# EAGLE schematic 20150312_QSE_TO_FMC_with_DP_R5.3_for_review (EAGLE 7.2.0), part 1 of 2

## Sheet 1 of 3: HS Diff Links
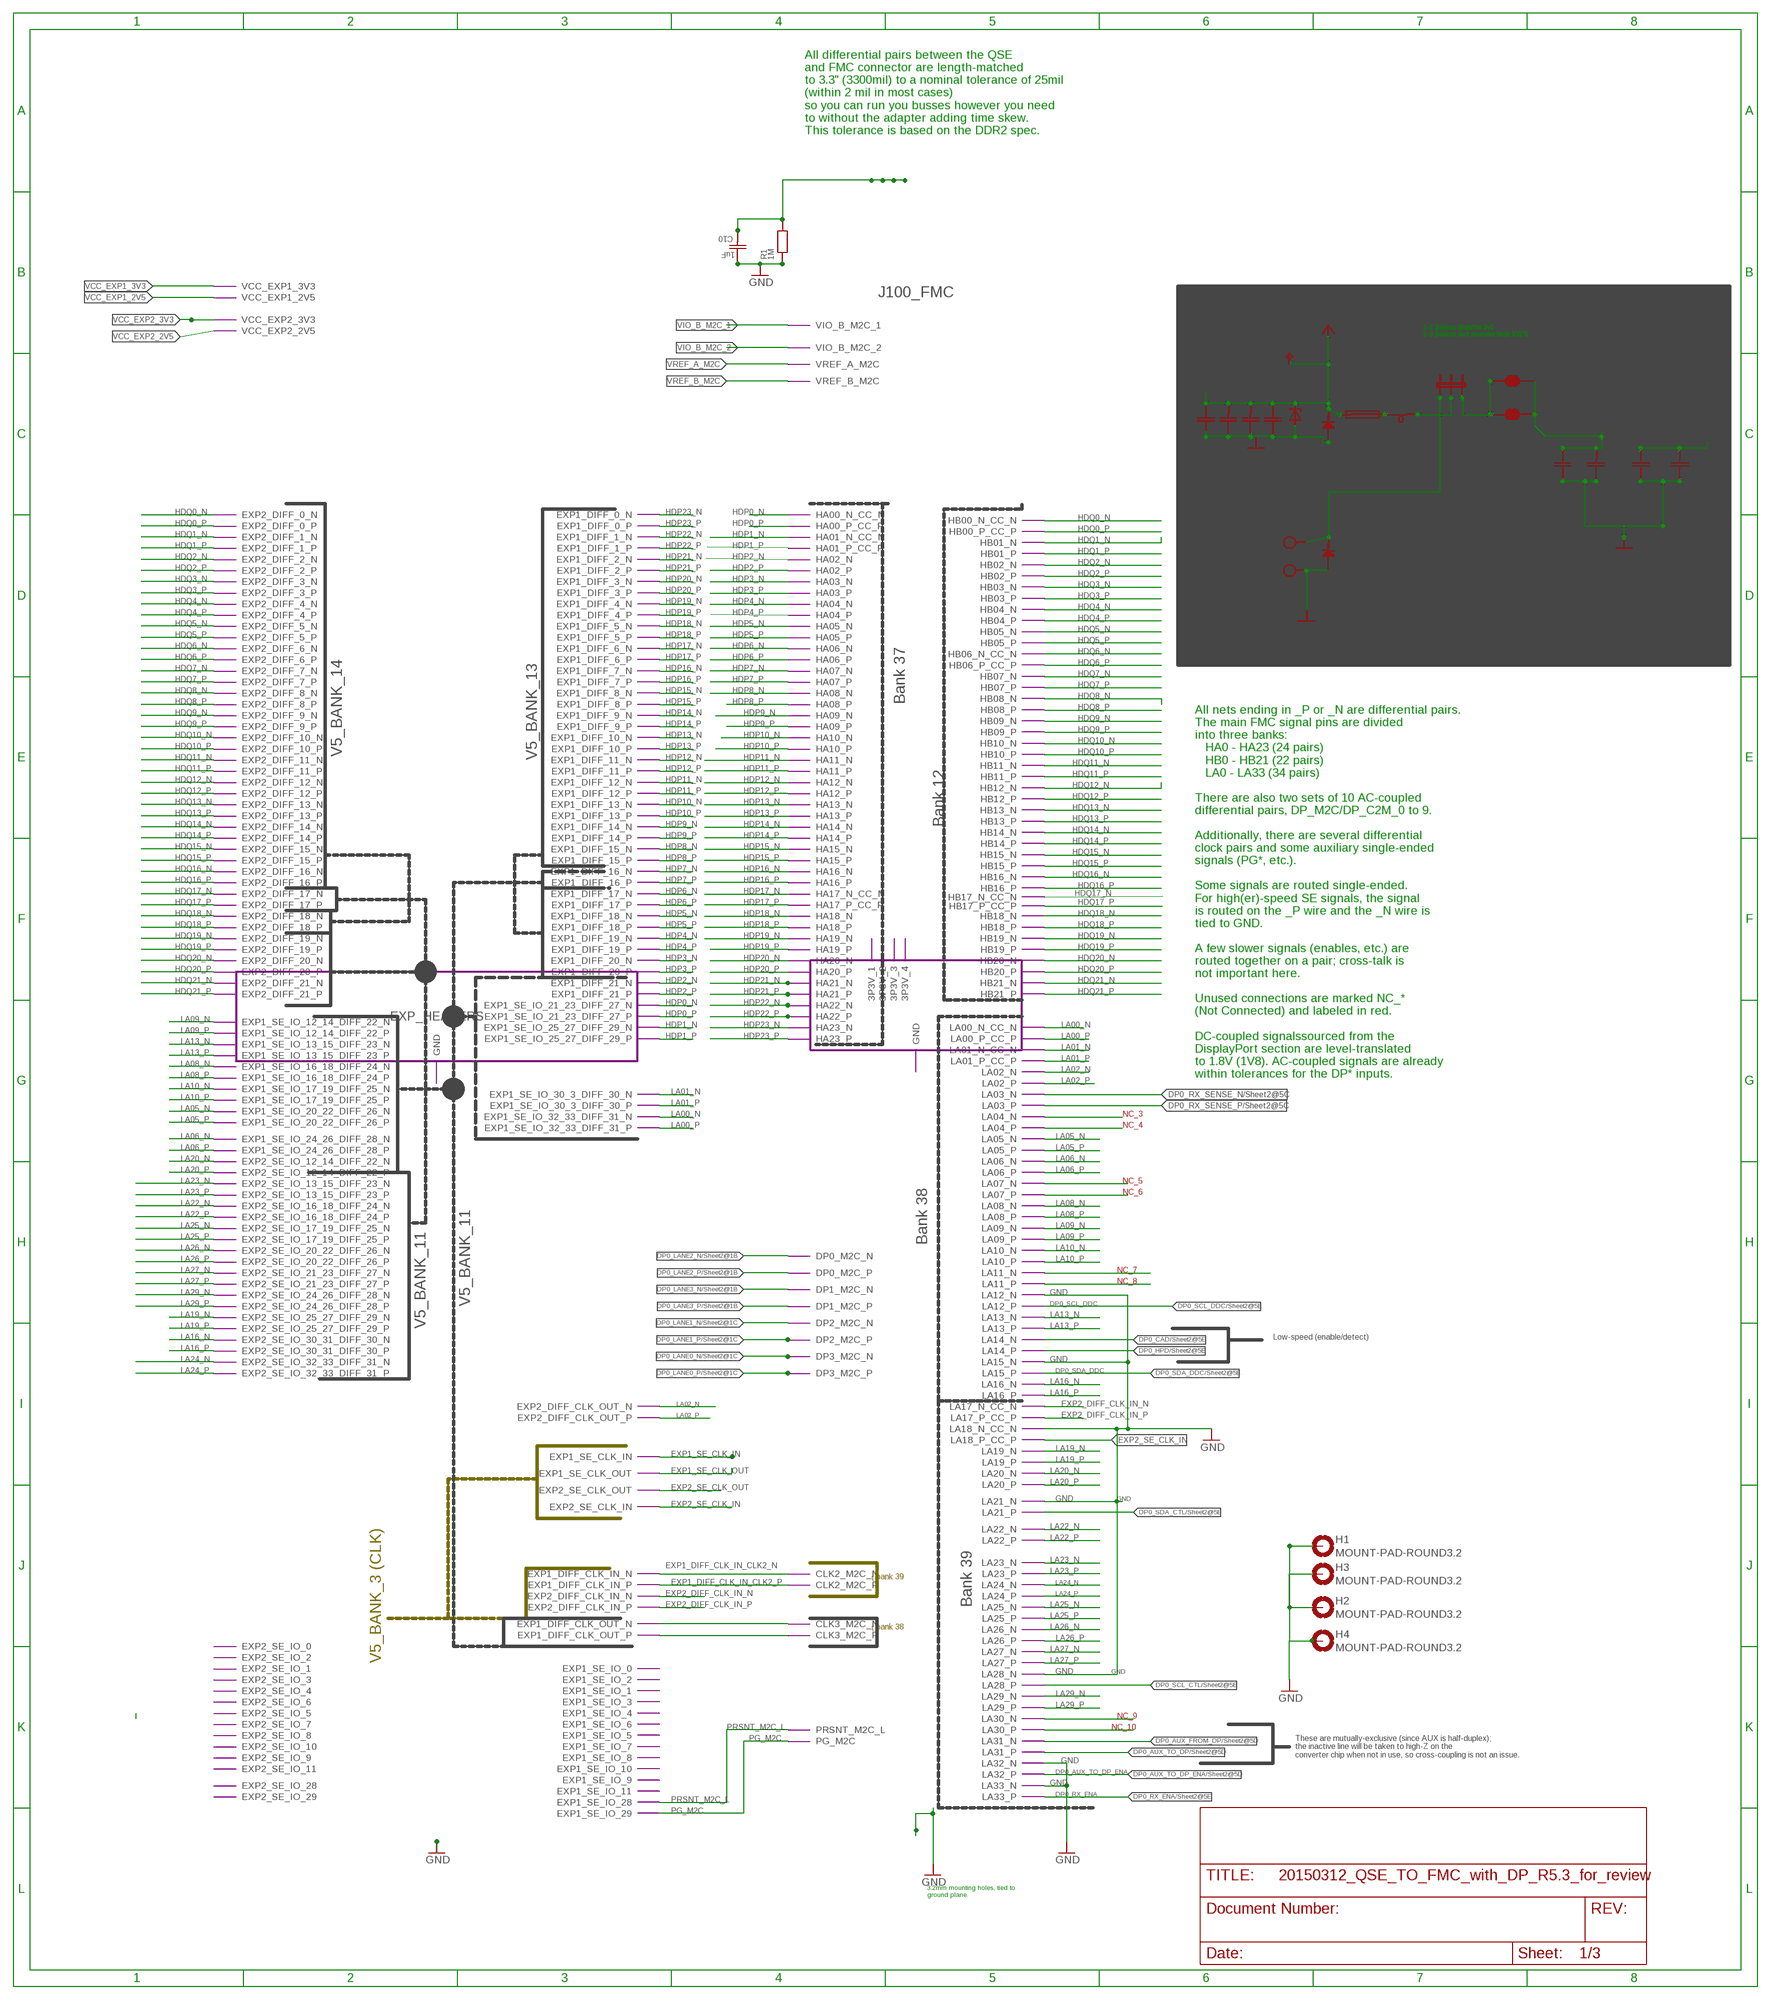
[diagram p0: schematic, sheet 1]

### Parts
C1  10nF  GRM188R71H103KA01D  [CAPC1608X85N]
C2  10nF  GRM188R71H103KA01D  [CAPC1608X85N]
C3  10uF  GRM188R60J106ME47D  [CAPC1608X85N]
C4  10uF  GRM188R60J106ME47D  [CAPC1608X85N]
C5  10uF  GRM188R60J106ME47D  [CAPC1608X85N]
C6  10nF  GRM188R71H103KA01D  [CAPC1608X85N]
C7  10uF  GRM188R60J106ME47D  [CAPC1608X85N]
C8  10nF  GRM188R71H103KA01D  [CAPC1608X85N]
C10  1uF  GRM155R61A105KE15D  [CAPC1005X60N]
D1  BAS21W  [SOT65P210X100-3N]
D4  BAS21W  [SOT65P210X100-3N]
EXT_+3V3_IN  W237-102  [W237-102]
F1  PTC_0A5  MF-SMDF050  [MF-SMDF050]
FB1  SM-B5  [SM-B5]
H1  MOUNT-PAD-ROUND3.2  [3,2-PAD]
H2  MOUNT-PAD-ROUND3.2  [3,2-PAD]
H3  MOUNT-PAD-ROUND3.2  [3,2-PAD]
H4  MOUNT-PAD-ROUND3.2  [3,2-PAD]
JP1  3V3_SRC  JP2E  [JP2]
JP2  SJW  [SJW]
JP3  SJW  [SJW]
R1  1M  CRCW04021M00JNED  [RESC1005X40N]
TP1  +3v3  TPTP10R  [TP10R]
ZD1  3.6V  ZENER-DIODESMB  [SMB]

### Module instances
EXP_HEADERS = EXT_1_EXT_2 (part numbers offset by 400)
J100_FMC = FMC1

### Nets
+3V3 [power]: C1.2 C2.2 C3.2 C4.2 D4.3(C) F1.2 TP1.TP ZD1.C ; also sheet 2
DP0_AUX_FROM_DP [gen_sig]: port J100_FMC.LA31_N ; also sheet 2
DP0_AUX_TO_DP [gen_sig]: port J100_FMC.LA31_P ; also sheet 2
DP0_AUX_TO_DP_ENA [gen_sig]: port J100_FMC.LA32_P ; also sheet 2
DP0_CAD [gen_sig]: port J100_FMC.LA14_N ; also sheet 2
DP0_HPD [gen_sig]: port J100_FMC.LA14_P ; also sheet 2
DP0_LANE0_N [diff_sig]: port J100_FMC.DP3_M2C_N ; also sheet 2
DP0_LANE0_P [diff_sig]: port J100_FMC.DP3_M2C_P ; also sheet 2
DP0_LANE1_N [diff_sig]: port J100_FMC.DP2_M2C_N ; also sheet 2
DP0_LANE1_P [diff_sig]: port J100_FMC.DP2_M2C_P ; also sheet 2
DP0_LANE2_N [diff_sig]: port J100_FMC.DP0_M2C_N ; also sheet 2
DP0_LANE2_P [diff_sig]: port J100_FMC.DP0_M2C_P ; also sheet 2
DP0_LANE3_N [diff_sig]: port J100_FMC.DP1_M2C_N ; also sheet 2
DP0_LANE3_P [diff_sig]: port J100_FMC.DP1_M2C_P ; also sheet 2
DP0_RX_ENA [gen_sig]: port J100_FMC.LA33_P ; also sheet 2
DP0_RX_SENSE_N [diff_sig]: port J100_FMC.LA03_N ; also sheet 2
DP0_RX_SENSE_P [diff_sig]: port J100_FMC.LA03_P ; also sheet 2
DP0_SCL_CTL [gen_sig]: port J100_FMC.LA28_P ; also sheet 2
DP0_SCL_DDC [gen_sig]: port J100_FMC.LA12_P ; also sheet 2
DP0_SDA_CTL [gen_sig]: port J100_FMC.LA21_P ; also sheet 2
DP0_SDA_DDC [gen_sig]: port J100_FMC.LA15_P ; also sheet 2
EXP1_DIFF_CLK_IN_CLK2_N [diff_sig]: port J100_FMC.CLK2_M2C_N EXP_HEADERS.EXP1_DIFF_CLK_IN_N
EXP1_DIFF_CLK_IN_CLK2_P [diff_sig]: port EXP_HEADERS.EXP1_DIFF_CLK_IN_P J100_FMC.CLK2_M2C_P
EXP1_DIFF_CLK_OUT_CLK3_N [diff_sig]: port J100_FMC.CLK3_M2C_N EXP_HEADERS.EXP1_DIFF_CLK_OUT_N
EXP1_DIFF_CLK_OUT_CLK3_P [diff_sig]: port J100_FMC.CLK3_M2C_P EXP_HEADERS.EXP1_DIFF_CLK_OUT_P
EXP1_SE_CLK_IN [gen_sig]: port EXP_HEADERS.EXP1_SE_CLK_IN
EXP1_SE_CLK_OUT: port EXP_HEADERS.EXP1_SE_CLK_OUT
EXP2_DIFF_CLK_IN_N [diff_sig]: port EXP_HEADERS.EXP2_DIFF_CLK_IN_N J100_FMC.LA17_N_CC_N
EXP2_DIFF_CLK_IN_P [diff_sig]: port EXP_HEADERS.EXP2_DIFF_CLK_IN_P J100_FMC.LA17_P_CC_P
EXP2_SE_CLK_IN [diff_sig]: port EXP_HEADERS.EXP2_SE_CLK_IN J100_FMC.LA18_P_CC_P
EXP2_SE_CLK_OUT [diff_sig]: port EXP_HEADERS.EXP2_SE_CLK_OUT
FMC_3PV3_TERM: C10.2 R1.1 ; port J100_FMC.3P3V_4 J100_FMC.3P3V_3 J100_FMC.3P3V_2 J100_FMC.3P3V_1
GND [GND]: C1.1 C2.1 C3.1 C4.1 C5.1 C6.1 C7.1 C8.1 C10.1 D1.1(A) D4.1(A) EXT_+3V3_IN.2 H1.B3,2(MOUNT) H2.B3,2(MOUNT) H3.B3,2(MOUNT) H4.B3,2(MOUNT) R1.2 ZD1.A ; port EXP_HEADERS.GND J100_FMC.GND J100_FMC.LA18_N_CC_N J100_FMC.LA15_N J100_FMC.LA12_N J100_FMC.LA21_N J100_FMC.LA28_N J100_FMC.LA32_N J100_FMC.LA33_N ; also sheet 2
HDP0_N [diff_sig]: port J100_FMC.HA00_N_CC_N EXP_HEADERS.EXP1_SE_IO_21_23_DIFF_27_N
HDP0_P [diff_sig]: port J100_FMC.HA00_P_CC_P EXP_HEADERS.EXP1_SE_IO_21_23_DIFF_27_P
HDP1_N [diff_sig]: port J100_FMC.HA01_N_CC_N EXP_HEADERS.EXP1_SE_IO_25_27_DIFF_29_N
HDP1_P [diff_sig]: port J100_FMC.HA01_P_CC_P EXP_HEADERS.EXP1_SE_IO_25_27_DIFF_29_P
HDP2_N [diff_sig]: port J100_FMC.HA02_N EXP_HEADERS.EXP1_DIFF_21_N
HDP2_P [diff_sig]: port J100_FMC.HA02_P EXP_HEADERS.EXP1_DIFF_21_P
HDP3_N [diff_sig]: port J100_FMC.HA03_N EXP_HEADERS.EXP1_DIFF_20_N
HDP3_P [diff_sig]: port J100_FMC.HA03_P EXP_HEADERS.EXP1_DIFF_20_P
HDP4_N [diff_sig]: port J100_FMC.HA04_N EXP_HEADERS.EXP1_DIFF_19_N
HDP4_P [diff_sig]: port J100_FMC.HA04_P EXP_HEADERS.EXP1_DIFF_19_P
HDP5_N [diff_sig]: port J100_FMC.HA05_N EXP_HEADERS.EXP1_DIFF_18_N
HDP5_P [diff_sig]: port J100_FMC.HA05_P EXP_HEADERS.EXP1_DIFF_18_P
HDP6_N [diff_sig]: port J100_FMC.HA06_N EXP_HEADERS.EXP1_DIFF_17_N
HDP6_P [diff_sig]: port J100_FMC.HA06_P EXP_HEADERS.EXP1_DIFF_17_P
HDP7_N [diff_sig]: port J100_FMC.HA07_N EXP_HEADERS.EXP1_DIFF_16_N
HDP7_P [diff_sig]: port J100_FMC.HA07_P EXP_HEADERS.EXP1_DIFF_16_P
HDP8_N [diff_sig]: port J100_FMC.HA08_N EXP_HEADERS.EXP1_DIFF_15_N
HDP8_P [diff_sig]: port J100_FMC.HA08_P EXP_HEADERS.EXP1_DIFF_15_P
HDP9_N [diff_sig]: port J100_FMC.HA09_N EXP_HEADERS.EXP1_DIFF_14_N
HDP9_P [diff_sig]: port J100_FMC.HA09_P EXP_HEADERS.EXP1_DIFF_14_P
HDP10_N [diff_sig]: port J100_FMC.HA10_N EXP_HEADERS.EXP1_DIFF_13_N
HDP10_P [diff_sig]: port J100_FMC.HA10_P EXP_HEADERS.EXP1_DIFF_13_P
HDP11_N [diff_sig]: port J100_FMC.HA11_N EXP_HEADERS.EXP1_DIFF_12_N
HDP11_P [diff_sig]: port J100_FMC.HA11_P EXP_HEADERS.EXP1_DIFF_12_P
HDP12_N [diff_sig]: port J100_FMC.HA12_N EXP_HEADERS.EXP1_DIFF_11_N
HDP12_P [diff_sig]: port J100_FMC.HA12_P EXP_HEADERS.EXP1_DIFF_11_P
HDP13_N [diff_sig]: port J100_FMC.HA13_N EXP_HEADERS.EXP1_DIFF_10_N
HDP13_P [diff_sig]: port J100_FMC.HA13_P EXP_HEADERS.EXP1_DIFF_10_P
HDP14_N [diff_sig]: port J100_FMC.HA14_N EXP_HEADERS.EXP1_DIFF_9_N
HDP14_P [diff_sig]: port J100_FMC.HA14_P EXP_HEADERS.EXP1_DIFF_9_P
HDP15_N [diff_sig]: port J100_FMC.HA15_N EXP_HEADERS.EXP1_DIFF_8_N
HDP15_P [diff_sig]: port J100_FMC.HA15_P EXP_HEADERS.EXP1_DIFF_8_P
HDP16_N [diff_sig]: port J100_FMC.HA16_N EXP_HEADERS.EXP1_DIFF_7_N
HDP16_P [diff_sig]: port J100_FMC.HA16_P EXP_HEADERS.EXP1_DIFF_7_P
HDP17_N [diff_sig]: port J100_FMC.HA17_N_CC_N EXP_HEADERS.EXP1_DIFF_6_N
HDP17_P [diff_sig]: port J100_FMC.HA17_P_CC_P EXP_HEADERS.EXP1_DIFF_6_P
HDP18_N [diff_sig]: port J100_FMC.HA18_N EXP_HEADERS.EXP1_DIFF_5_N
HDP18_P [diff_sig]: port J100_FMC.HA18_P EXP_HEADERS.EXP1_DIFF_5_P
HDP19_N [diff_sig]: port J100_FMC.HA19_N EXP_HEADERS.EXP1_DIFF_4_N
HDP19_P [diff_sig]: port J100_FMC.HA19_P EXP_HEADERS.EXP1_DIFF_4_P
HDP20_N [diff_sig]: port J100_FMC.HA20_N EXP_HEADERS.EXP1_DIFF_3_N
HDP20_P [diff_sig]: port J100_FMC.HA20_P EXP_HEADERS.EXP1_DIFF_3_P
HDP21_N [diff_sig]: port J100_FMC.HA21_N EXP_HEADERS.EXP1_DIFF_2_N
HDP21_P [diff_sig]: port J100_FMC.HA21_P EXP_HEADERS.EXP1_DIFF_2_P
HDP22_N [diff_sig]: port J100_FMC.HA22_N EXP_HEADERS.EXP1_DIFF_1_N
HDP22_P [diff_sig]: port J100_FMC.HA22_P EXP_HEADERS.EXP1_DIFF_1_P
HDP23_N [diff_sig]: port J100_FMC.HA23_N EXP_HEADERS.EXP1_DIFF_0_N
HDP23_P [diff_sig]: port J100_FMC.HA23_P EXP_HEADERS.EXP1_DIFF_0_P
HDQ0_N [diff_sig]: port J100_FMC.HB00_N_CC_N EXP_HEADERS.EXP2_DIFF_0_N
HDQ0_P [diff_sig]: port J100_FMC.HB00_P_CC_P EXP_HEADERS.EXP2_DIFF_0_P
HDQ1_N [diff_sig]: port J100_FMC.HB01_N EXP_HEADERS.EXP2_DIFF_1_N
HDQ1_P [diff_sig]: port J100_FMC.HB01_P EXP_HEADERS.EXP2_DIFF_1_P
HDQ2_N [diff_sig]: port J100_FMC.HB02_N EXP_HEADERS.EXP2_DIFF_2_N
HDQ2_P [diff_sig]: port J100_FMC.HB02_P EXP_HEADERS.EXP2_DIFF_2_P
HDQ3_N [diff_sig]: port J100_FMC.HB03_N EXP_HEADERS.EXP2_DIFF_3_N
HDQ3_P [diff_sig]: port J100_FMC.HB03_P EXP_HEADERS.EXP2_DIFF_3_P
HDQ4_N [diff_sig]: port J100_FMC.HB04_N EXP_HEADERS.EXP2_DIFF_4_N
HDQ4_P [diff_sig]: port J100_FMC.HB04_P EXP_HEADERS.EXP2_DIFF_4_P
HDQ5_N [diff_sig]: port J100_FMC.HB05_N EXP_HEADERS.EXP2_DIFF_5_N
HDQ5_P [diff_sig]: port J100_FMC.HB05_P EXP_HEADERS.EXP2_DIFF_5_P
HDQ6_N [diff_sig]: port J100_FMC.HB06_N_CC_N EXP_HEADERS.EXP2_DIFF_6_N
HDQ6_P [diff_sig]: port J100_FMC.HB06_P_CC_P EXP_HEADERS.EXP2_DIFF_6_P
HDQ7_N [diff_sig]: port J100_FMC.HB07_N EXP_HEADERS.EXP2_DIFF_7_N
HDQ7_P [diff_sig]: port J100_FMC.HB07_P EXP_HEADERS.EXP2_DIFF_7_P
HDQ8_N [diff_sig]: port J100_FMC.HB08_N EXP_HEADERS.EXP2_DIFF_8_N
HDQ8_P [diff_sig]: port J100_FMC.HB08_P EXP_HEADERS.EXP2_DIFF_8_P
HDQ9_N [diff_sig]: port J100_FMC.HB09_N EXP_HEADERS.EXP2_DIFF_9_N
HDQ9_P [diff_sig]: port J100_FMC.HB09_P EXP_HEADERS.EXP2_DIFF_9_P
HDQ10_N [diff_sig]: port J100_FMC.HB10_N EXP_HEADERS.EXP2_DIFF_10_N
HDQ10_P [diff_sig]: port J100_FMC.HB10_P EXP_HEADERS.EXP2_DIFF_10_P
HDQ11_N [diff_sig]: port J100_FMC.HB11_N EXP_HEADERS.EXP2_DIFF_11_N
HDQ11_P [diff_sig]: port J100_FMC.HB11_P EXP_HEADERS.EXP2_DIFF_11_P
HDQ12_N [diff_sig]: port J100_FMC.HB12_N EXP_HEADERS.EXP2_DIFF_12_N
HDQ12_P [diff_sig]: port J100_FMC.HB12_P EXP_HEADERS.EXP2_DIFF_12_P
HDQ13_N [diff_sig]: port J100_FMC.HB13_N EXP_HEADERS.EXP2_DIFF_13_N
HDQ13_P [diff_sig]: port J100_FMC.HB13_P EXP_HEADERS.EXP2_DIFF_13_P
HDQ14_N [diff_sig]: port J100_FMC.HB14_N EXP_HEADERS.EXP2_DIFF_14_N
HDQ14_P [diff_sig]: port J100_FMC.HB14_P EXP_HEADERS.EXP2_DIFF_14_P
HDQ15_N [diff_sig]: port J100_FMC.HB15_N EXP_HEADERS.EXP2_DIFF_15_N
HDQ15_P [diff_sig]: port J100_FMC.HB15_P EXP_HEADERS.EXP2_DIFF_15_P
HDQ16_N [diff_sig]: port J100_FMC.HB16_N EXP_HEADERS.EXP2_DIFF_16_N
HDQ16_P [diff_sig]: port J100_FMC.HB16_P EXP_HEADERS.EXP2_DIFF_16_P
HDQ17_N [diff_sig]: port J100_FMC.HB17_N_CC_N EXP_HEADERS.EXP2_DIFF_17_N
HDQ17_P [diff_sig]: port J100_FMC.HB17_P_CC_P EXP_HEADERS.EXP2_DIFF_17_P
HDQ18_N [diff_sig]: port J100_FMC.HB18_N EXP_HEADERS.EXP2_DIFF_18_N
HDQ18_P [diff_sig]: port J100_FMC.HB18_P EXP_HEADERS.EXP2_DIFF_18_P
HDQ19_N [diff_sig]: port J100_FMC.HB19_N EXP_HEADERS.EXP2_DIFF_19_N
HDQ19_P [diff_sig]: port J100_FMC.HB19_P EXP_HEADERS.EXP2_DIFF_19_P
HDQ20_N [diff_sig]: port J100_FMC.HB20_N EXP_HEADERS.EXP2_DIFF_20_N
HDQ20_P [diff_sig]: port J100_FMC.HB20_P EXP_HEADERS.EXP2_DIFF_20_P
HDQ21_N [diff_sig]: port J100_FMC.HB21_N EXP_HEADERS.EXP2_DIFF_21_N
HDQ21_P [diff_sig]: port J100_FMC.HB21_P EXP_HEADERS.EXP2_DIFF_21_P
LA00_N [diff_sig]: port J100_FMC.LA00_N_CC_N EXP_HEADERS.EXP1_SE_IO_32_33_DIFF_31_N
LA00_P [diff_sig]: port J100_FMC.LA00_P_CC_P EXP_HEADERS.EXP1_SE_IO_32_33_DIFF_31_P
LA01_N [diff_sig]: port J100_FMC.LA01_N_CC_N EXP_HEADERS.EXP1_SE_IO_30_3_DIFF_30_N
LA01_P [diff_sig]: port J100_FMC.LA01_P_CC_P EXP_HEADERS.EXP1_SE_IO_30_3_DIFF_30_P
LA02_N [diff_sig]: port J100_FMC.LA02_N EXP_HEADERS.EXP2_DIFF_CLK_OUT_N
LA02_P [diff_sig]: port J100_FMC.LA02_P EXP_HEADERS.EXP2_DIFF_CLK_OUT_P
LA05_N [diff_sig]: port J100_FMC.LA05_N EXP_HEADERS.EXP1_SE_IO_20_22_DIFF_26_N
LA05_P [diff_sig]: port J100_FMC.LA05_P EXP_HEADERS.EXP1_SE_IO_20_22_DIFF_26_P
LA06_N [diff_sig]: port J100_FMC.LA06_N EXP_HEADERS.EXP1_SE_IO_24_26_DIFF_28_N
LA06_P [diff_sig]: port J100_FMC.LA06_P EXP_HEADERS.EXP1_SE_IO_24_26_DIFF_28_P
LA08_N [diff_sig]: port J100_FMC.LA08_N EXP_HEADERS.EXP1_SE_IO_16_18_DIFF_24_N
LA08_P [diff_sig]: port J100_FMC.LA08_P EXP_HEADERS.EXP1_SE_IO_16_18_DIFF_24_P
LA09_N [diff_sig]: port J100_FMC.LA09_N EXP_HEADERS.EXP1_SE_IO_12_14_DIFF_22_N
LA09_P [diff_sig]: port J100_FMC.LA09_P EXP_HEADERS.EXP1_SE_IO_12_14_DIFF_22_P
LA10_N [diff_sig]: port J100_FMC.LA10_N EXP_HEADERS.EXP1_SE_IO_17_19_DIFF_25_N
LA10_P [diff_sig]: port J100_FMC.LA10_P EXP_HEADERS.EXP1_SE_IO_17_19_DIFF_25_P
LA13_N [diff_sig]: port J100_FMC.LA13_N EXP_HEADERS.EXP1_SE_IO_13_15_DIFF_23_N
LA13_P [diff_sig]: port J100_FMC.LA13_P EXP_HEADERS.EXP1_SE_IO_13_15_DIFF_23_P
LA16_N [diff_sig]: port J100_FMC.LA16_N EXP_HEADERS.EXP2_SE_IO_30_31_DIFF_30_N
LA16_P [diff_sig]: port J100_FMC.LA16_P EXP_HEADERS.EXP2_SE_IO_30_31_DIFF_30_P
LA19_N [diff_sig]: port J100_FMC.LA19_N EXP_HEADERS.EXP2_SE_IO_25_27_DIFF_29_N
LA19_P [diff_sig]: port J100_FMC.LA19_P EXP_HEADERS.EXP2_SE_IO_25_27_DIFF_29_P
LA20_N [diff_sig]: port EXP_HEADERS.EXP2_SE_IO_12_14_DIFF_22_N J100_FMC.LA20_N
LA20_P [diff_sig]: port EXP_HEADERS.EXP2_SE_IO_12_14_DIFF_22_P J100_FMC.LA20_P
LA22_N [diff_sig]: port J100_FMC.LA22_N EXP_HEADERS.EXP2_SE_IO_16_18_DIFF_24_N
LA22_P [diff_sig]: port J100_FMC.LA22_P EXP_HEADERS.EXP2_SE_IO_16_18_DIFF_24_P
LA23_N [diff_sig]: port J100_FMC.LA23_N EXP_HEADERS.EXP2_SE_IO_13_15_DIFF_23_N
LA23_P [diff_sig]: port EXP_HEADERS.EXP2_SE_IO_13_15_DIFF_23_P J100_FMC.LA23_P
LA24_N [diff_sig]: port J100_FMC.LA24_N EXP_HEADERS.EXP2_SE_IO_32_33_DIFF_31_N
LA24_P [diff_sig]: port J100_FMC.LA24_P EXP_HEADERS.EXP2_SE_IO_32_33_DIFF_31_P
LA25_N [diff_sig]: port EXP_HEADERS.EXP2_SE_IO_17_19_DIFF_25_N J100_FMC.LA25_N
LA25_P [diff_sig]: port EXP_HEADERS.EXP2_SE_IO_17_19_DIFF_25_P J100_FMC.LA25_P
LA26_N [diff_sig]: port EXP_HEADERS.EXP2_SE_IO_20_22_DIFF_26_N J100_FMC.LA26_N
LA26_P [diff_sig]: port EXP_HEADERS.EXP2_SE_IO_20_22_DIFF_26_P J100_FMC.LA26_P
LA27_N [diff_sig]: port EXP_HEADERS.EXP2_SE_IO_21_23_DIFF_27_N J100_FMC.LA27_N
LA27_P [diff_sig]: port EXP_HEADERS.EXP2_SE_IO_21_23_DIFF_27_P J100_FMC.LA27_P
LA29_N [diff_sig]: port EXP_HEADERS.EXP2_SE_IO_24_26_DIFF_28_N J100_FMC.LA29_N
LA29_P [diff_sig]: port EXP_HEADERS.EXP2_SE_IO_24_26_DIFF_28_P J100_FMC.LA29_P
N$1 [power]: JP1.3 JP2.1 JP3.1
N$5 [gen_sig]: F1.1 FB1.1
N$6 [power]: D1.3(C) EXT_+3V3_IN.1 JP1.1
N$8 [power]: FB1.2 JP1.2
NC_3 [diff_sig]: port J100_FMC.LA04_N
NC_4 [diff_sig]: port J100_FMC.LA04_P
NC_5 [gen_sig]: port J100_FMC.LA07_N
NC_6 [gen_sig]: port J100_FMC.LA07_P
NC_7 [gen_sig]: port J100_FMC.LA11_N
NC_8 [gen_sig]: port J100_FMC.LA11_P
NC_9 [diff_sig]: port J100_FMC.LA30_N
NC_10 [diff_sig]: port J100_FMC.LA30_P
PG_M2C [gen_sig]: port J100_FMC.PG_M2C EXP_HEADERS.EXP1_SE_IO_29
PRSNT_M2C_L [gen_sig]: port J100_FMC.PRSNT_M2C_L EXP_HEADERS.EXP1_SE_IO_28
VCC_EXP1_2V5: port EXP_HEADERS.VCC_EXP1_2V5
VCC_EXP1_3V3: C7.2 C8.2 ; port EXP_HEADERS.VCC_EXP1_3V3
VCC_EXP2_2V5 [power]: port EXP_HEADERS.VCC_EXP2_2V5
VCC_EXP2_3V3 [power]: C5.2 C6.2 JP2.2 JP3.2 ; port EXP_HEADERS.VCC_EXP2_3V3
VIO_B_M2C_1: port J100_FMC.VIO_B_M2C_1
VIO_B_M2C_2: port J100_FMC.VIO_B_M2C_2
VREF_A_M2C: port J100_FMC.VREF_A_M2C
VREF_B_M2C: port J100_FMC.VREF_B_M2C
Unconnected: D1.2(NC) D4.2(NC)

### Notes on the sheet
- All differential pairs between the QSE
  and FMC connector are length-matched
  to 3.3" (3300mil) to a nominal tolerance of 25mil
  (within 2 mil in most cases)
  so you can run you busses however you need 
  to without the adapter adding time skew. 
  This tolerance is based on the DDR2 spec.
- POWER ROUTING
- 3V3 supply to 
  DisplayPort circuitry
- 1-2 Selects External 3v3
  2-3 Selects 3v3 sourced from EXP2
- SMD Jumper links
  Bridge to route power to 
  the DisplayPort circuitry.
  In normal operation, these 
  would be bridged with  
  solder bridges or 0-Ohm
  resistors.
- EXP1's 3V3 rail 
  is not used.
- Bypass close to
  QSE connectors.
- Input protection:
  Reverse-current diode (D4)
  0.5A PTC fuse (F1)
  3.3V 3W Zener (ZD1)
- +3V3
- GND
- Option for external 3v3 power.
  Note that no provisions are made
  for on-board regulation, though fusing
  and Zener bypass are provided for 
  protection. Do not apply more than
  3.3V (nominal) to this input.
- V5_BANK_14
- Bank 37
- V5_BANK_13
- Bank 12
- All nets ending in _P or _N are differential pairs. 
  The main FMC signal pins are divided 
  into three banks:
     HA0 - HA23 (24 pairs)
     HB0 - HB21 (22 pairs)
     LA0 - LA33 (34 pairs)
  
  There are also two sets of 10 AC-coupled
  differential pairs, DP_M2C/DP_C2M_0 to 9.
  
  Additionally, there are several differential
  clock pairs and some auxiliary single-ended
  signals (PG*, etc.).
  
  Some signals are routed single-ended.
  For high(er)-speed SE signals, the signal
  is routed on the _P wire and the _N wire is
  tied to GND.
  
  A few slower signals (enables, etc.) are 
  routed together on a pair; cross-talk is
  not important here.
  
  Unused connections are marked NC_* 
  (Not Connected) and labeled in red.
  
  DC-coupled signalssourced from the
  DisplayPort section are level-translated
  to 1.8V (1V8). AC-coupled signals are already
  within tolerances for the DP* inputs.
- Bank 38
- V5_BANK_11
- V5_BANK_11
- Low-speed (enable/detect)
- { bank 39
- Bank 39
- { bank 38
- V5_BANK_3 (CLK)
- These are mutually-exclusive (since AUX is half-duplex);
  the inactive line will be taken to high-Z on the 
  converter chip when not in use, so cross-coupling is not an issue.
- 3.2mm mounting holes, tied to
  ground plane.

## Sheet 2 of 3: DisplayPort Circuitry
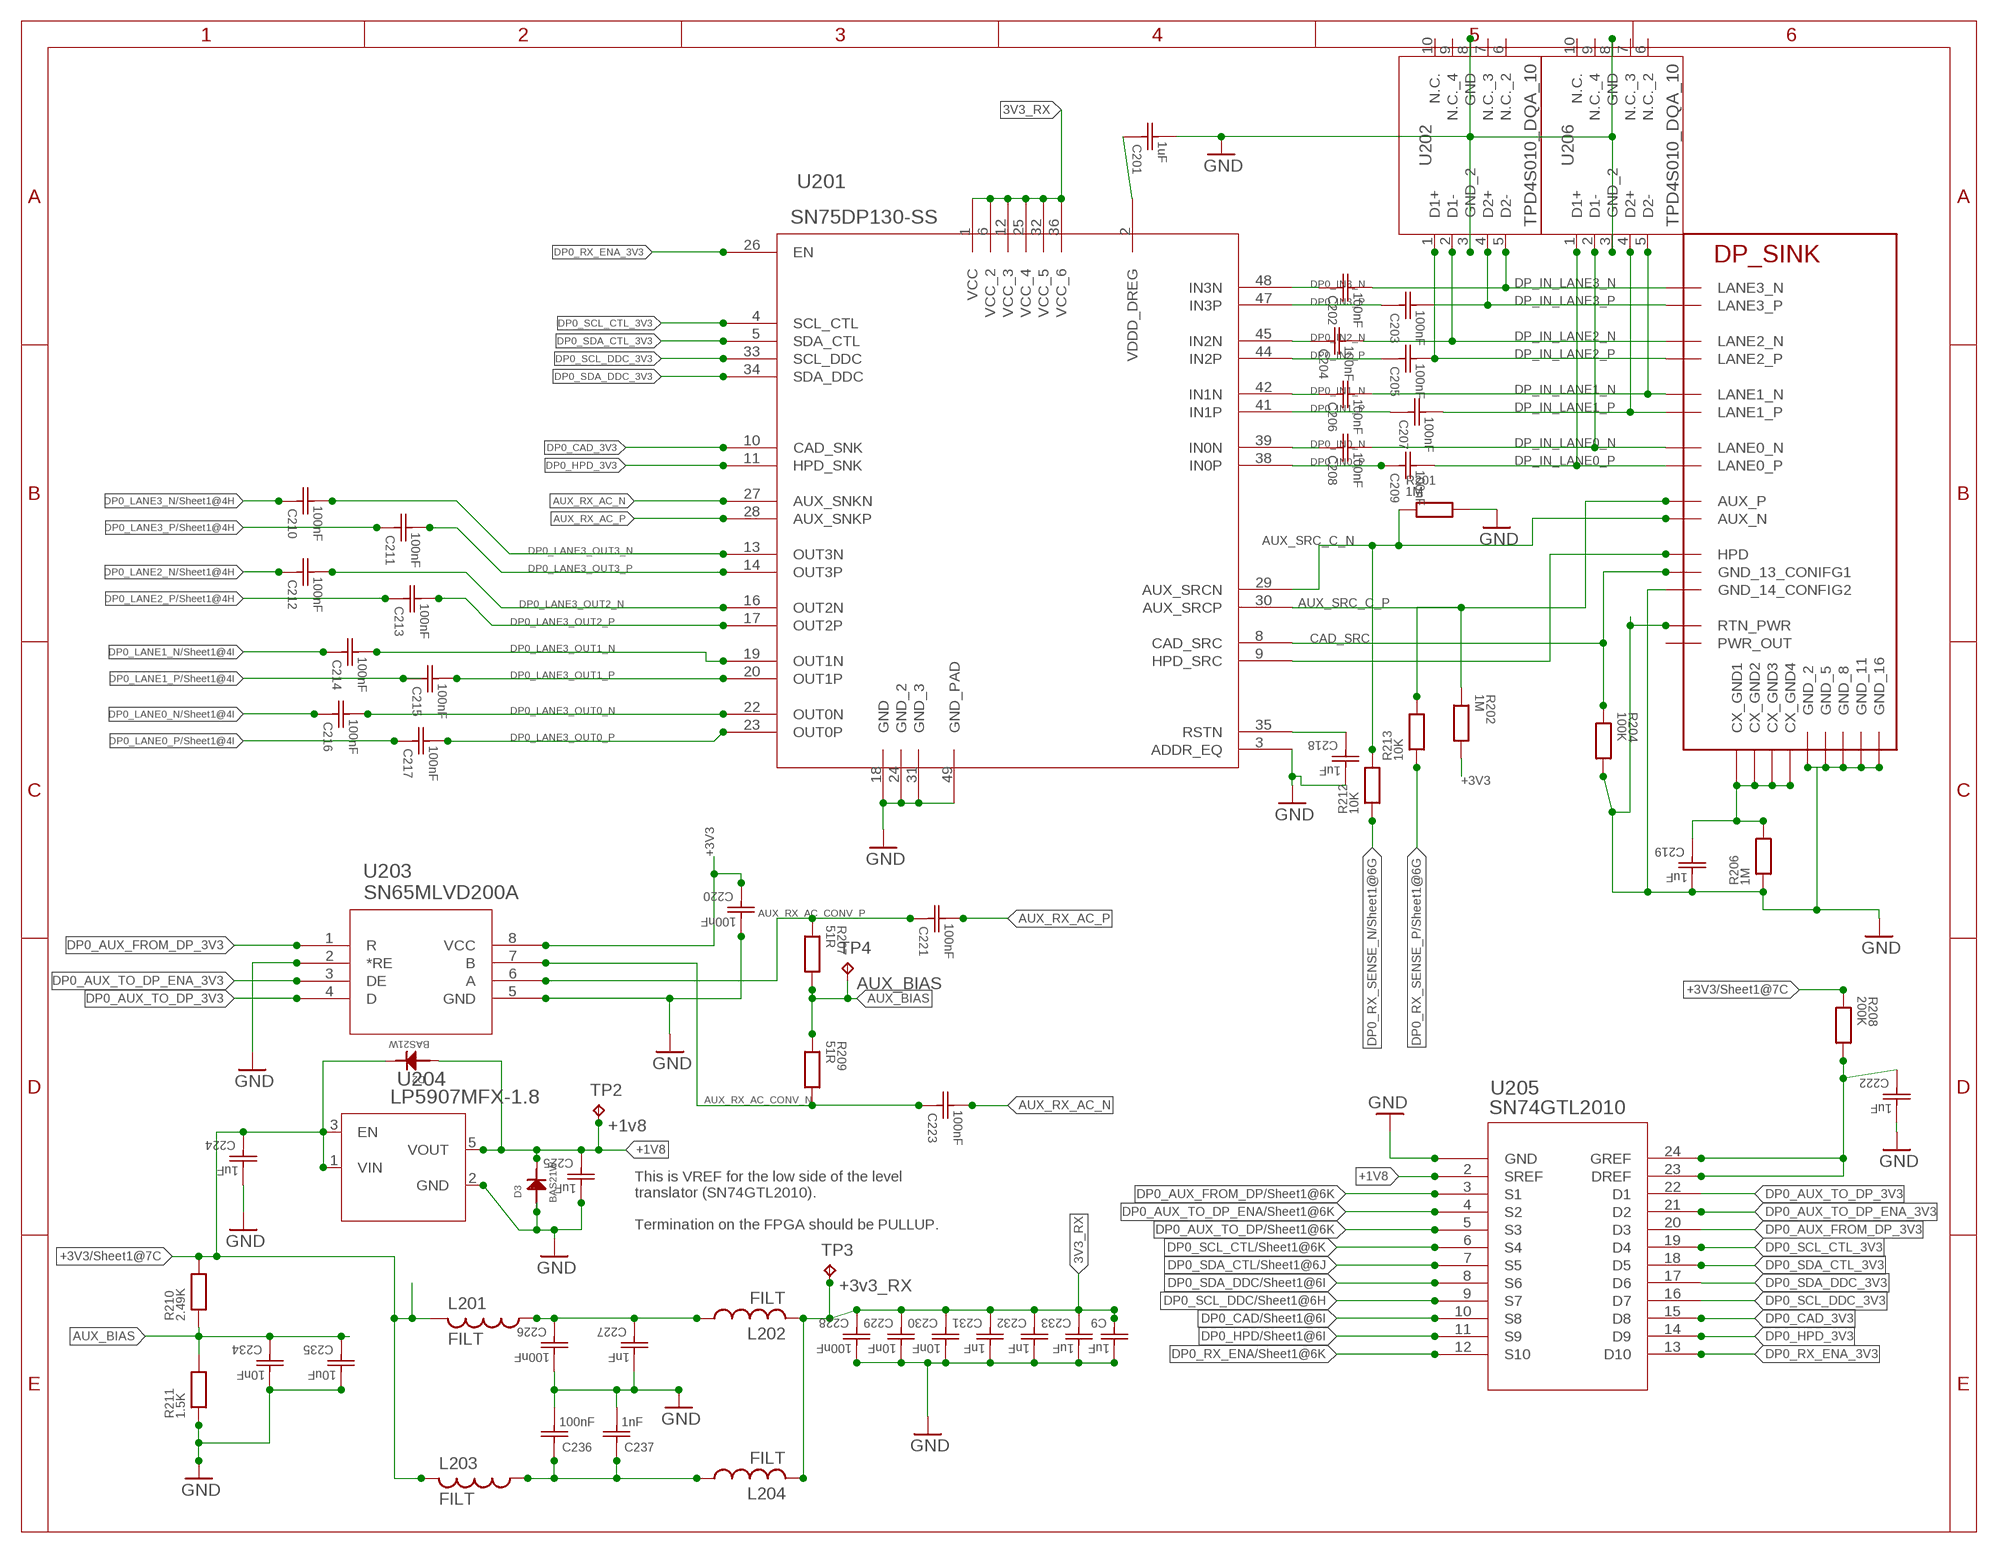
[diagram p1: schematic, sheet 2]

### Parts
C9  1uF  GRM155R61A105KE15D  [CAPC1005X60N]
C201  1uF  GRM155R61A105KE15D  [CAPC1005X60N]
C202  100nF  GRM155R71C104KA88D  [CAPC1005X60N]
C203  100nF  GRM155R71C104KA88D  [CAPC1005X60N]
C204  100nF  GRM155R71C104KA88D  [CAPC1005X60N]
C205  100nF  GRM155R71C104KA88D  [CAPC1005X60N]
C206  100nF  GRM155R71C104KA88D  [CAPC1005X60N]
C207  100nF  GRM155R71C104KA88D  [CAPC1005X60N]
C208  100nF  GRM155R71C104KA88D  [CAPC1005X60N]
C209  100nF  GRM155R71C104KA88D  [CAPC1005X60N]
C210  100nF  GRM155R71C104KA88D  [CAPC1005X60N]
C211  100nF  GRM155R71C104KA88D  [CAPC1005X60N]
C212  100nF  GRM155R71C104KA88D  [CAPC1005X60N]
C213  100nF  GRM155R71C104KA88D  [CAPC1005X60N]
C214  100nF  GRM155R71C104KA88D  [CAPC1005X60N]
C215  100nF  GRM155R71C104KA88D  [CAPC1005X60N]
C216  100nF  GRM155R71C104KA88D  [CAPC1005X60N]
C217  100nF  GRM155R71C104KA88D  [CAPC1005X60N]
C218  1uF  GRM155R61A105KE15D  [CAPC1005X60N]
C219  1uF  GRM155R61A105KE15D  [CAPC1005X60N]
C220  100nF  GRM155R71C104KA88D  [CAPC1005X60N]
C221  100nF  GRM155R71C104KA88D  [CAPC1005X60N]
C222  1uF  GRM155R61A105KE15D  [CAPC1005X60N]
C223  100nF  GRM155R71C104KA88D  [CAPC1005X60N]
C224  1uF  GRM155R61A105KE15D  [CAPC1005X60N]
C225  1uF  GRM155R61A105KE15D  [CAPC1005X60N]
C226  100nF  GRM155R71C104KA88D  [CAPC1005X60N]
C227  1nF  GRM1555C1H102JA01D  [CAPC1005X60N]
C228  100nF  GRM155R71C104KA88D  [CAPC1005X60N]
C229  10nF  GRM155R71E103KA01D  [CAPC1005X60N]
C230  10nF  GRM155R71E103KA01D  [CAPC1005X60N]
C231  1nF  GRM1555C1H102JA01D  [CAPC1005X60N]
C232  1nF  GRM1555C1H102JA01D  [CAPC1005X60N]
C233  1uF  GRM155R61A105KE15D  [CAPC1005X60N]
C234  10nF  GRM155R71E103KA01D  [CAPC1005X60N]
C235  10uF  GRM188R60J106ME47D  [CAPC1608X85N]
C236  100nF  GRM155R71C104KA88D  [CAPC1005X60N]
C237  1nF  GRM1555C1H102JA01D  [CAPC1005X60N]
D2  BAS21W  [SOT65P210X100-3N]
D3  BAS21W  [SOT65P210X100-3N]
J1  DP0_IN  SD-47272DP_SINK  [SD-47272]
L201  FILT  L-USL0603  [R0603]
L202  FILT  L-USL0603  [R0603]
L203  FILT  L-USL0603  [R0603]
L204  FILT  L-USL0603  [R0603]
R201  1M  CRCW04021M00FKED  [RESC1005X40N]
R202  1M  CRCW04021M00FKED  [RESC1005X40N]
R204  100K  CRCW0402100KFKED  [RESC1005X40N]
R206  1M  CRCW04021M00JNED  [RESC1005X40N]
R207  51R  CRCW040251R0FKED  [RESC1005X40N]
R208  200K  CRCW0402200KJNED  [RESC1005X40N]
R209  51R  CRCW040251R0FKED  [RESC1005X40N]
R210  2.49K  CRCW04022K49FKED  [RESC1005X40N]
R211  1.5K  CRCW04021K50FKED  [RESC1005X40N]
R212  10K  CRCW040210K0JNED  [RESC1005X40N]
R213  10K  CRCW040210K0JNED  [RESC1005X40N]
TP2  +1v8  TPTP10R  [TP10R]
TP3  +3v3_RX  TPTP10R  [TP10R]
TP4  AUX_BIAS  TPTP10R  [TP10R]
U201  SN75DP130-SS  SN75DP130SN75DP130-SS  [RGZ48_5P6X5P6]
U202  TPD4S010_DQA_10  [DQA10]
U203  SN65MLVD200A  SN65MLVD200A_D_8  [D8]
U204  LP5907MFX-1.8  LP5907_DBV_5  [DBV5]
U205  SN74GTL2010  SN74GTL2010_PW_24  [PW24]
U206  TPD4S010_DQA_10  [DQA10]

### Nets
3V3_RX [power]: C9.2 C228.2 C229.2 C230.2 C231.2 C232.2 C233.2 L202.2 L204.2 TP3.TP U201.1(VCC) U201.6(VCC_2) U201.12(VCC_3) U201.25(VCC_4) U201.32(VCC_5) U201.36(VCC_6)
+1V8 [diff_sig]: C225.2 D2.1(A) D3.3(C) TP2.TP U204.5(VOUT) U205.2(SREF)
+3V3 [power]: C220.2 C224.2 D2.3(C) L201.2 L203.2 R202.1 R208.2 R210.1 U203.8(VCC) U204.1(VIN) U204.3(EN) ; also sheet 1
AUX_BIAS [diff_sig]: C234.2 C235.2 R207.1 R209.2 R210.2 R211.1 TP4.TP
AUX_RX_AC_CONV_N [DP]: C223.2 R209.1 U203.7(B)
AUX_RX_AC_CONV_P [DP]: C221.2 R207.2 U203.6(A)
AUX_RX_AC_N [DP]: C223.1 U201.27(AUX_SNKN)
AUX_RX_AC_P [DP]: C221.1 U201.28(AUX_SNKP)
AUX_SRC_C_N [DP]: J1.P$17(AUX_N) R201.2 R212.1 U201.29(AUX_SRCN)
AUX_SRC_C_P [DP]: J1.P$15(AUX_P) R202.2 R213.1 U201.30(AUX_SRCP)
CAD_SRC [gen_sig]: J1.P$13(GND_13_CONIFG1) R204.2 U201.8(CAD_SRC)
DP0_AUX_FROM_DP [gen_sig]: U205.3(S1) ; also sheet 1
DP0_AUX_FROM_DP_3V3 [diff_sig]: U203.1(R) U205.20(D3)
DP0_AUX_TO_DP [gen_sig]: U205.5(S3) ; also sheet 1
DP0_AUX_TO_DP_3V3 [diff_sig]: U203.4(D) U205.22(D1)
DP0_AUX_TO_DP_ENA [gen_sig]: U205.4(S2) ; also sheet 1
DP0_AUX_TO_DP_ENA_3V3 [diff_sig]: U203.3(DE) U205.21(D2)
DP0_CAD [gen_sig]: U205.10(S8) ; also sheet 1
DP0_CAD_3V3 [diff_sig]: U201.10(CAD_SNK) U205.15(D8)
DP0_HPD [gen_sig]: U205.11(S9) ; also sheet 1
DP0_HPD_3V3 [diff_sig]: U201.11(HPD_SNK) U205.14(D9)
DP0_IN0_N [DP]: C208.2 U201.39(IN0N)
DP0_IN0_P [DP]: C209.2 U201.38(IN0P)
DP0_IN1_N [DP]: C206.2 U201.42(IN1N)
DP0_IN1_P [DP]: C207.2 U201.41(IN1P)
DP0_IN2_N [DP]: C204.2 U201.45(IN2N)
DP0_IN2_P [DP]: C205.2 U201.44(IN2P)
DP0_IN3_N [DP]: C202.2 U201.48(IN3N)
DP0_IN3_P [DP]: C203.2 U201.47(IN3P)
DP0_LANE0_N [diff_sig]: C216.2 ; also sheet 1
DP0_LANE0_P [diff_sig]: C217.2 ; also sheet 1
DP0_LANE1_N [diff_sig]: C214.2 ; also sheet 1
DP0_LANE1_P [diff_sig]: C215.2 ; also sheet 1
DP0_LANE2_N [diff_sig]: C212.2 ; also sheet 1
DP0_LANE2_P [diff_sig]: C213.2 ; also sheet 1
DP0_LANE3_N [diff_sig]: C210.2 ; also sheet 1
DP0_LANE3_OUT0_N [DP]: C216.1 U201.22(OUT0N)
DP0_LANE3_OUT0_P [DP]: C217.1 U201.23(OUT0P)
DP0_LANE3_OUT1_N [DP]: C214.1 U201.19(OUT1N)
DP0_LANE3_OUT1_P [DP]: C215.1 U201.20(OUT1P)
DP0_LANE3_OUT2_N [DP]: C212.1 U201.16(OUT2N)
DP0_LANE3_OUT2_P [DP]: C213.1 U201.17(OUT2P)
DP0_LANE3_OUT3_N [DP]: C210.1 U201.13(OUT3N)
DP0_LANE3_OUT3_P [DP]: C211.1 U201.14(OUT3P)
DP0_LANE3_P [diff_sig]: C211.2 ; also sheet 1
DP0_RX_ENA [gen_sig]: U205.12(S10) ; also sheet 1
DP0_RX_ENA_3V3 [diff_sig]: U201.26(EN) U205.13(D10)
DP0_RX_SENSE_N [diff_sig]: R212.2 ; also sheet 1
DP0_RX_SENSE_P [diff_sig]: R213.2 ; also sheet 1
DP0_SCL_CTL [gen_sig]: U205.6(S4) ; also sheet 1
DP0_SCL_CTL_3V3 [gen_sig]: U201.4(SCL_CTL) U205.19(D4)
DP0_SCL_DDC [gen_sig]: U205.9(S7) ; also sheet 1
DP0_SCL_DDC_3V3 [gen_sig]: U201.33(SCL_DDC) U205.16(D7)
DP0_SDA_CTL [gen_sig]: U205.7(S5) ; also sheet 1
DP0_SDA_CTL_3V3 [gen_sig]: U201.5(SDA_CTL) U205.18(D5)
DP0_SDA_DDC [gen_sig]: U205.8(S6) ; also sheet 1
DP0_SDA_DDC_3V3 [gen_sig]: U201.34(SDA_DDC) U205.17(D6)
DP_CX_GND [diff_sig]: C219.2 J1.P$21(CX_GND1) J1.P$22(CX_GND2) J1.P$23(CX_GND3) J1.P$24(CX_GND4) R206.1
DP_IN_LANE0_N [DP]: C208.1 J1.P$10(LANE0_N) U206.2(D1-)
DP_IN_LANE0_P [DP]: C209.1 J1.P$12(LANE0_P) U206.1(D1+)
DP_IN_LANE1_N [DP]: C206.1 J1.P$7(LANE1_N) U206.5(D2-)
DP_IN_LANE1_P [DP]: C207.1 J1.P$9(LANE1_P) U206.4(D2+)
DP_IN_LANE2_N [DP]: C204.1 J1.P$4(LANE2_N) U202.2(D1-)
DP_IN_LANE2_P [DP]: C205.1 J1.P$6(LANE2_P) U202.1(D1+)
DP_IN_LANE3_N [DP]: C202.1 J1.P$1(LANE3_N) U202.5(D2-)
DP_IN_LANE3_P [DP]: C203.1 J1.P$3(LANE3_P) U202.4(D2+)
GND [GND]: C9.1 C201.1 C218.1 C219.1 C220.1 C222.1 C224.1 C225.1 C226.1 C227.1 C228.1 C229.1 C230.1 C231.1 C232.1 C233.1 C234.1 C235.1 C236.1 C237.1 D3.1(A) J1.P$2(GND_2) J1.P$5(GND_5) J1.P$8(GND_8) J1.P$11(GND_11) J1.P$14(GND_14_CONFIG2) J1.P$16(GND_16) J1.P$19(RTN_PWR) R201.1 R204.1 R206.2 R211.2 U201.3(ADDR_EQ) U201.18(GND) U201.24(GND_2) U201.31(GND_3) U201.49(GND_PAD) U202.3(GND_2) U202.8(GND) U203.2(*RE) U203.5(GND) U204.2(GND) U205.1(GND) U206.3(GND_2) U206.8(GND) ; also sheet 1
HPD_SRC [gen_sig]: J1.P$18(HPD) U201.9(HPD_SRC)
N$15 [diff_sig]: C236.2 C237.2 L203.1 L204.1
N$16 [diff_sig]: C226.2 C227.2 L201.1 L202.1
N$17 [diff_sig]: C222.2 R208.1 U205.23(DREF) U205.24(GREF)
N$20 [gen_sig]: C201.2 U201.2(VDDD_DREG)
N$36 [diff_sig]: C218.2 U201.35(RSTN)
Unconnected: D2.2(NC) D3.2(NC) U201.7(NC) U201.15(NC_2) U201.21(NC_3) U201.37(NC_4) U201.40(NC_5) U201.43(NC_6) U201.46(NC_7) U202.6(N.C._2) U202.7(N.C._3) U202.9(N.C._4) U202.10(N.C.) U204.4(NC) U206.6(N.C._2) U206.7(N.C._3) U206.9(N.C._4) U206.10(N.C.)

### Notes on the sheet
- This is VREF for the low side of the level 
  translator (SN74GTL2010).
  
  Termination on the FPGA should be PULLUP.

## Sheet 3 of 3
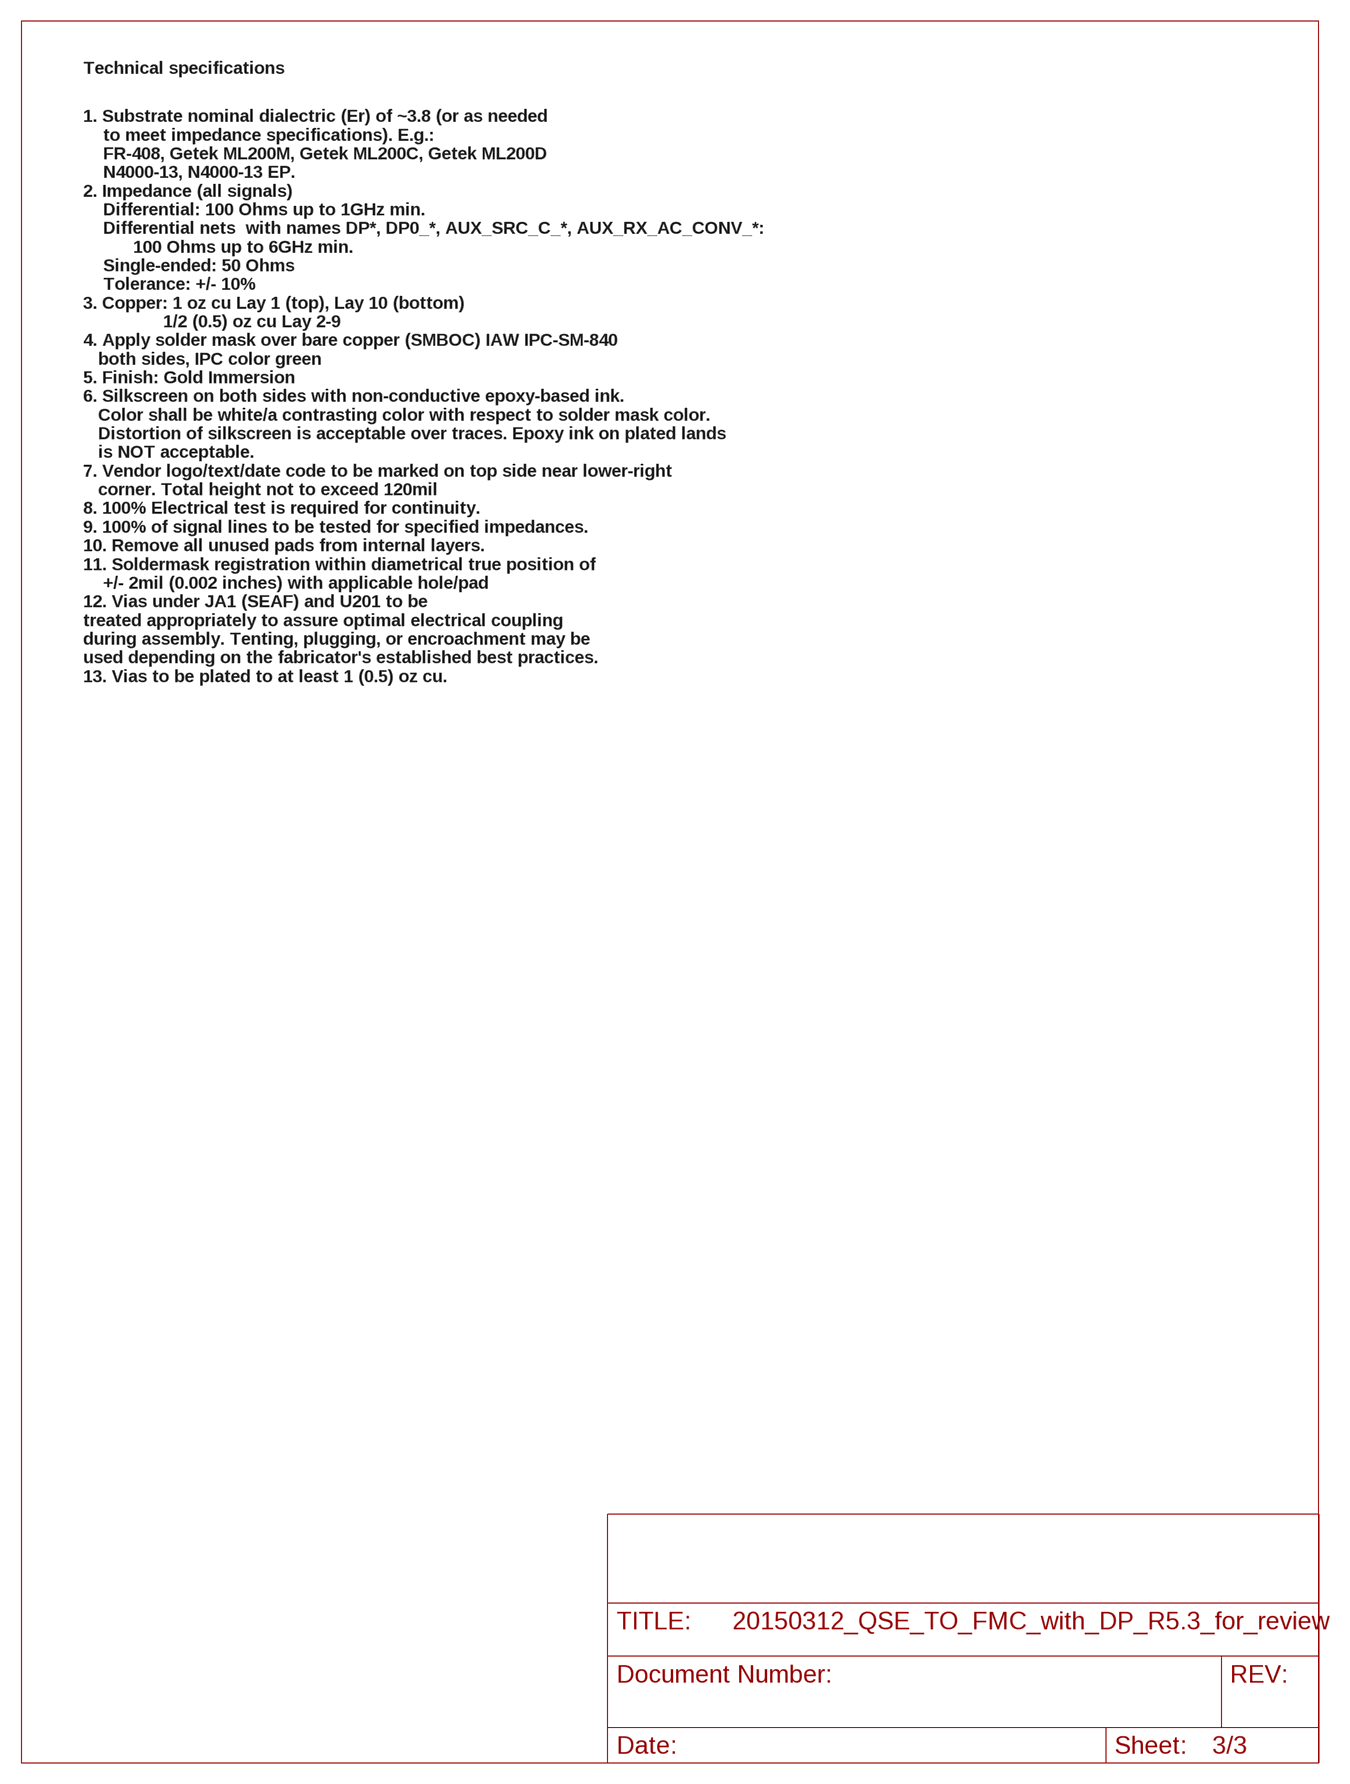
[diagram p2: schematic, sheet 3]

### Notes on the sheet
- Technical specifications
- 1. Substrate nominal dialectric (Er) of ~3.8 (or as needed
      to meet impedance specifications). E.g.:
      FR-408, Getek ML200M, Getek ML200C, Getek ML200D
      N4000-13, N4000-13 EP.
  2. Impedance (all signals)
      Differential: 100 Ohms up to 1GHz min.
      Differential nets  with names DP*, DP0_*, AUX_SRC_C_*, AUX_RX_AC_CONV_*: 
            100 Ohms up to 6GHz min.
      Single-ended: 50 Ohms
      Tolerance: +/- 10%
  3. Copper: 1 oz cu Lay 1 (top), Lay 10 (bottom)
                  1/2 (0.5) oz cu Lay 2-9
  4. Apply solder mask over bare copper (SMBOC) IAW IPC-SM-840
     both sides, IPC color green
  5. Finish: Gold Immersion
  6. Silkscreen on both sides with non-conductive epoxy-based ink.
     Color shall be white/a contrasting color with respect to solder mask color.
     Distortion of silkscreen is acceptable over traces. Epoxy ink on plated lands
     is NOT acceptable.
  7. Vendor logo/text/date code to be marked on top side near lower-right 
     corner. Total height not to exceed 120mil
  8. 100% Electrical test is required for continuity.
  9. 100% of signal lines to be tested for specified impedances. 
  10. Remove all unused pads from internal layers.
  11. Soldermask registration within diametrical true position of 
      +/- 2mil (0.002 inches) with applicable hole/pad
  12. Vias under JA1 (SEAF) and U201 to be 
  treated appropriately to assure optimal electrical coupling 
  during assembly. Tenting, plugging, or encroachment may be
  used depending on the fabricator's established best practices.
  13. Vias to be plated to at least 1 (0.5) oz cu.

## Power pins joined to a net without a drawn wire
PWR_OUT: J1.P$20(PWR_OUT)

## Library data of the parts
C1 C2 C6 C8 = Murata_By_element14_Batch_1:GRM188R71H103KA01D: CAPACITOR, 0603; MPN: GRM188R71H103KA01D; OC_FARNELL: 8819980; OC_NEWARK: 97K0612; SUPPLIER: Murata; TOLERANCE: ±10%; VOLTAGERATING: 50V
C3 C4 = Murata_By_element14_Batch_1:GRM188R60J106ME47D: CAPACITOR, 0603; MPN: GRM188R60J106ME47D; OC_FARNELL: 1735528; OC_NEWARK: 24R6334; SUPPLIER: Murata; TOLERANCE: ±20%; VOLTAGERATING: 6.3V
C5 C7 = Murata_By_element14_Batch_1:GRM188R60J106ME47D: CAPACITOR, 0603; MF: KEMET; MPN: GRM188R60J106ME47D; OC_FARNELL: 1735528; OC_NEWARK: 24R6334; SUPPLIER: Murata; TOLERANCE: ±20%; VOLTAGERATING: 6.3V
C9 C10 C201 C218 C219 C222 C233 = Murata_By_element14_Batch_1:GRM155R61A105KE15D: CAPACITOR, 0402; MANUFACTURER: MURATA; MPN: GRM155R61A105KE15D; OC_FARNELL: 1735523; OC_NEWARK: 24R6333; PART#: GRM188B31A225KE33; SUPPLIER: Murata; TOLERANCE: ±10%; VOLTAGERATING: 10V
C202-C217 C221 C223 = Murata_By_element14_Batch_1:GRM155R71C104KA88D: CAPACITOR, 0402; MPN: GRM155R71C104KA88D; OC_FARNELL: 8819742; OC_NEWARK: 38K1647; SUPPLIER: Murata; TOLERANCE: ±10%; VOLTAGERATING: 16V
C220 C226 C228 C236 = Murata_By_element14_Batch_1:GRM155R71C104KA88D: CAPACITOR, 0402; MANUFACTURER: MURATA; MPN: GRM155R71C104KA88D; OC_FARNELL: 8819742; OC_NEWARK: 38K1647; PART#: GRM188B31H104MA92; SUPPLIER: Murata; TOLERANCE: ±10%; VOLTAGERATING: 16V
C224 C225 = Murata_By_element14_Batch_1:GRM155R61A105KE15D: CAPACITOR, 0402; MANUFACTURER: MURATA; MPN: GRM155R61A105KE15D; OC_FARNELL: 1735523; OC_NEWARK: 24R6333; SUPPLIER: Murata; TOLERANCE: ±10%; VOLTAGERATING: 10V
C227 C231 C232 C237 = Murata_By_element14_Batch_1:GRM1555C1H102JA01D: CAPACITOR, 0402; MANUFACTURER: MURATA; MPN: GRM1555C1H102JA01D; OC_FARNELL: 8819556; OC_NEWARK: 38K1651; PART#: GRM1885C1E102JA01; SUPPLIER: Murata; TOLERANCE: ±5%; VOLTAGERATING: 50V
C229 C230 C234 = Murata_By_element14_Batch_1:GRM155R71E103KA01D: CAPACITOR, 0402; MANUFACTURER: MURATA; MPN: GRM155R71E103KA01D; OC_FARNELL: 8819734; OC_NEWARK: 37K6460; PART#: GRM1885C1H103JA01; SUPPLIER: Murata; TOLERANCE: ±10%; VOLTAGERATING: 25V
C235 = Murata_By_element14_Batch_1:GRM188R60J106ME47D: CAPACITOR, 0603; MANUFACTURER: MURATA; MPN: GRM188R60J106ME47D; OC_FARNELL: 1735528; OC_NEWARK: 24R6334; SUPPLIER: Murata; TOLERANCE: ±20%; VOLTAGERATING: 6.3V
D1-D4 = Diodes_Inc_By_element14_Batch_1:BAS21W: SURFACE MOUNT FAST SWITCHING DIODE; MPN: BAS21W; OC_FARNELL: 1902407; OC_NEWARK: 55T0013; PACKAGE: SOT-323-3; SUPPLIER: DIODES INC.
EXT_+3V3_IN = con-wago-500:W237-102: WAGO SCREW CLAMP; MPN: 237-102; OC_FARNELL: unknown; OC_NEWARK: 70K9898
F1 = fuse:MF-SMDF: MF-SMDF Series - PRC Resettable Fuses Source: http://www.farnell.com/datasheets/716597.pdf
FB1 = inductor-neosid:SM-B: INDUCTOR SMD Bead inductor; OC_FARNELL: unknown; OC_NEWARK: unknown
H1-H4 = holes:MOUNT-PAD-ROUND: MOUNTING PAD, round; OC_NEWARK: unknown
J1 = con-molex:SD-47272
JP1 = jumper:JP2E: JUMPER
JP2 JP3 = jumper:SJ: SMD solder JUMPER
L201 L202 = rcl:L-US: INDUCTOR, American symbol; MANUFACTURER: MURATA; PART#: BLM18HE152SN1
L203 L204 = rcl:L-US: INDUCTOR, American symbol; MANUFACTURER: MURATA; PART#: BLM18HE601SN1
R1 R206 = Vishay_By_element14_Batch_1:CRCW04021M00JNED: RESISTOR, 0402; MPN: CRCW04021M00JNED; OC_FARNELL: 1514661; OC_NEWARK: 59M6694; SUPPLIER: VISHAY DALE ELECTRONICS; TOLERANCE: ±5%; VALUE: 1M Ohm; WATTAGE: 0.063 W
R201 R202 = Vishay_By_element14_Batch_1:CRCW04021M00FKED: RESISTOR, 0402; MPN: CRCW04021M00FKED; OC_FARNELL: 1469667; OC_NEWARK: 52K6593; SUPPLIER: Vishay; TOLERANCE: ±1%; VALUE: 1M Ohms; WATTAGE: 0.063W
R204 = Vishay_By_element14_Batch_1:CRCW0402100KFKED: RESISTOR, 0402; MPN: CRCW0402100KFKED; OC_FARNELL: 1469671; OC_NEWARK: -; SUPPLIER: Vishay; TOLERANCE: ±1%; VALUE: 100K Ohms; WATTAGE: 0.063W
R207 R209 = Vishay_By_element14_Batch_1:CRCW040251R0FKED: RESISTOR, 0402; MPN: CRCW040251R0FKED; OC_FARNELL: 1563602; OC_NEWARK: 72M6802; SUPPLIER: VISHAY DALE ELECTRONICS; TOLERANCE: ±1%; VALUE: 51 Ohms; WATTAGE: 0.063 W
R208 = Vishay_By_element14_Batch_1:CRCW0402200KJNED: RESISTOR, 0402; MPN: CRCW0402200KJNED; OC_FARNELL: 1571696; OC_NEWARK: 89M6629; SUPPLIER: VISHAY DALE ELECTRONICS; TOLERANCE: ±5%; VALUE: 200K Ohms; WATTAGE: 0.063 W
R210 = Vishay_By_element14_Batch_1:CRCW04022K49FKED: RESISTOR, 0402; MPN: CRCW04022K49FKED; OC_FARNELL: 1469690; OC_NEWARK: 52K6803; SUPPLIER: Vishay; TOLERANCE: ±1%; VALUE: 2.49K Ohms; WATTAGE: 0.063W
R211 = Vishay_By_element14_Batch_1:CRCW04021K50FKED: RESISTOR, 0402; MPN: CRCW04021K50FKED; OC_FARNELL: 1653201; OC_NEWARK: 52K6575; SUPPLIER: Vishay; TOLERANCE: ±1%; VALUE: 1.5K Ohms; WATTAGE: 0.063W
R212 R213 = Vishay_By_element14_Batch_1:CRCW040210K0JNED: RESISTOR, 0402; MPN: CRCW040210K0JNED; OC_FARNELL: 1815062; OC_NEWARK: 19K8682; SUPPLIER: VISHAY DALE ELECTRONICS; TOLERANCE: ±5%; VALUE: 10K Ohms; WATTAGE: 0.063 W
TP1-TP4 = testpad:TP: Test pad
U201 = TI:SN75DP130
U202 U206 = TI:TPD4S010_DQA_10; DATASHEETURL: http://www.ti.com/lit/gpn/TPD4S010; DESCRIPTION: 4-Channel ESD Solution for High-Speed Differential Interface; FAMILY_NAME: ESD Solution; GENERIC_PART_NUMBER: TPD4S010; INDUSTRY_STD_PKG_TYPE: SON; MANUFACTURER: Texas Instruments; MANUFACTURER_PART_NUMBER: tpd4s010_dqa_10; PACKAGE_DESIGNATOR: DQA; PIN_COUNT: 10; VENDOR: Texas Instruments
U203 = TI:SN65MLVD200A_D_8; DATASHEETURL: http://www.ti.com/lit/gpn/SN65MLVD200A; DESCRIPTION: Half-Duplex M-LVDS Transceiver; FAMILY_NAME: M-LVDS PHY (<500MBPS); GENERIC_PART_NUMBER: SN65MLVD200A; INDUSTRY_STD_PKG_TYPE: SOIC; MANUFACTURER: Texas Instruments; MANUFACTURER_PART_NUMBER: sn65mlvd200a_d_8; PACKAGE_DESIGNATOR: D; PIN_COUNT: 8; VENDOR: Texas Instruments
U204 = TI:LP5907_DBV_5; MANUFACTURER_PART_NUMBER: lp5907_dbv_5; VENDOR: Texas Instruments
U205 = TI:SN74GTL2010_PW_24; DATASHEETURL: http://www.ti.com/lit/gpn/SN74GTL2010; DESCRIPTION: 10-Bit Voltage Clamp; FAMILY_NAME: TTL/GTL/Open Drain FET Type Bidirectional Translator; GENERIC_PART_NUMBER: SN74GTL2010; INDUSTRY_STD_PKG_TYPE: TSSOP; MANUFACTURER: Texas Instruments; MANUFACTURER_PART_NUMBER: sn74gtl2010_pw_24; PACKAGE_DESIGNATOR: PW; PIN_COUNT: 24; VENDOR: Texas Instruments
ZD1 = diode:ZENER-DIODE: Z-Diode; MANUFACTURER: ON SEMI; PART#: 1SMB5914BT3G; POWER: 3W

## Module EXT_1_EXT_2
Ports: GND(pwr) EXP1_DIFF_0_N(io) EXP1_DIFF_0_P(io) EXP1_DIFF_1_N(io) EXP1_DIFF_1_P(io) EXP1_DIFF_2_N(io) EXP1_DIFF_2_P(io) EXP1_DIFF_3_N(io) EXP1_DIFF_3_P(io) EXP1_DIFF_4_N(io) EXP1_DIFF_4_P(io) EXP1_DIFF_5_N(io) EXP1_DIFF_5_P(io) EXP1_DIFF_6_N(io) EXP1_DIFF_6_P(io) EXP1_DIFF_7_N(io) EXP1_DIFF_7_P(io) EXP1_DIFF_8_N(io) EXP1_DIFF_8_P(io) EXP1_DIFF_9_N(io) EXP1_DIFF_9_P(io) EXP1_DIFF_10_N(io) EXP1_DIFF_10_P(io) EXP1_DIFF_11_N(io) EXP1_DIFF_11_P(io) EXP1_DIFF_12_N(io) EXP1_DIFF_12_P(io) EXP1_DIFF_13_N(io) EXP1_DIFF_13_P(io) EXP1_DIFF_14_N(io) EXP1_DIFF_14_P(io) EXP1_DIFF_15_N(io) EXP1_DIFF_15_P(io) EXP1_DIFF_16_N(io) EXP1_DIFF_16_P(io) EXP1_DIFF_17_N(io) EXP1_DIFF_17_P(io) EXP1_DIFF_18_N(io) EXP1_DIFF_18_P(io) EXP1_DIFF_19_N(io) EXP1_DIFF_19_P(io) EXP1_DIFF_20_N(io) EXP1_DIFF_20_P(io) EXP1_DIFF_21_N(io) EXP1_DIFF_21_P(io) EXP1_SE_IO_12_14_DIFF_22_N(io) EXP1_SE_IO_12_14_DIFF_22_P(io) EXP1_SE_IO_13_15_DIFF_23_N(io) EXP1_SE_IO_13_15_DIFF_23_P(io) EXP1_SE_IO_16_18_DIFF_24_N(io) EXP1_SE_IO_16_18_DIFF_24_P(io) EXP1_SE_IO_17_19_DIFF_25_N(io) EXP1_SE_IO_17_19_DIFF_25_P(io) EXP1_SE_IO_20_22_DIFF_26_N(io) EXP1_SE_IO_20_22_DIFF_26_P(io) EXP1_SE_IO_21_23_DIFF_27_N(io) EXP1_SE_IO_21_23_DIFF_27_P(io) EXP1_SE_IO_24_26_DIFF_28_N(io) EXP1_SE_IO_24_26_DIFF_28_P(io) EXP1_SE_IO_25_27_DIFF_29_N(io) EXP1_SE_IO_25_27_DIFF_29_P(io) EXP1_SE_IO_30_3_DIFF_30_N(io) EXP1_SE_IO_30_3_DIFF_30_P(io) EXP1_SE_IO_32_33_DIFF_31_N(io) EXP1_SE_IO_32_33_DIFF_31_P(io) EXP2_DIFF_0_N(io) EXP2_DIFF_0_P(io) EXP2_DIFF_1_N(io) EXP2_DIFF_1_P(io) EXP2_DIFF_2_N(io) EXP2_DIFF_2_P(io) EXP2_DIFF_3_N(io) EXP2_DIFF_3_P(io) EXP2_DIFF_4_N(io) EXP2_DIFF_4_P(io) EXP2_DIFF_5_N(io) EXP2_DIFF_5_P(io) EXP2_DIFF_6_N(io) EXP2_DIFF_6_P(io) EXP2_DIFF_7_N(io) EXP2_DIFF_7_P(io) EXP2_DIFF_8_N(io) EXP2_DIFF_8_P(io) EXP2_DIFF_9_N(io) EXP2_DIFF_9_P(io) EXP2_DIFF_10_N(io) EXP2_DIFF_10_P(io) EXP2_DIFF_11_N(io) EXP2_DIFF_11_P(io) EXP2_DIFF_12_N(io) EXP2_DIFF_12_P(io) EXP2_DIFF_13_N(io) EXP2_DIFF_13_P(io) EXP2_DIFF_14_N(io) EXP2_DIFF_14_P(io) EXP2_DIFF_15_N(io) EXP2_DIFF_15_P(io) EXP2_DIFF_16_N(io) EXP2_DIFF_16_P(io) EXP2_DIFF_17_N(io) EXP2_DIFF_17_P(io) EXP2_DIFF_18_N(io) EXP2_DIFF_18_P(io) EXP2_DIFF_19_N(io) EXP2_DIFF_19_P(io) EXP2_DIFF_20_N(io) EXP2_DIFF_20_P(io) EXP2_DIFF_21_N(io) EXP2_DIFF_21_P(io) EXP2_SE_IO_16_18_DIFF_24_N(io) EXP2_SE_IO_16_18_DIFF_24_P(io) EXP2_SE_IO_17_19_DIFF_25_N(io) EXP2_SE_IO_17_19_DIFF_25_P(io) EXP2_SE_IO_20_22_DIFF_26_N(io) EXP2_SE_IO_20_22_DIFF_26_P(io) EXP2_SE_IO_21_23_DIFF_27_N(io) EXP2_SE_IO_21_23_DIFF_27_P(io) EXP2_SE_IO_24_26_DIFF_28_N(io) EXP2_SE_IO_24_26_DIFF_28_P(io) EXP2_SE_IO_25_27_DIFF_29_N(io) EXP2_SE_IO_25_27_DIFF_29_P(io) EXP2_SE_IO_30_31_DIFF_30_N(io) EXP2_SE_IO_30_31_DIFF_30_P(io) EXP2_SE_IO_32_33_DIFF_31_N(io) EXP2_SE_IO_32_33_DIFF_31_P(io) EXP1_DIFF_CLK_IN_N(io) EXP1_DIFF_CLK_IN_P(io) EXP2_DIFF_CLK_IN_N(io) EXP2_DIFF_CLK_IN_P(io) EXP2_SE_CLK_OUT(out) EXP1_SE_CLK_IN(io) EXP2_SE_CLK_IN(io) EXP1_SE_IO_0(nc) EXP1_SE_IO_2(nc) EXP1_SE_IO_1(nc) EXP1_SE_IO_3(nc) EXP1_SE_IO_4(nc) EXP1_SE_IO_6(nc) EXP1_SE_IO_5(nc) EXP1_SE_IO_7(nc) EXP1_SE_IO_8(nc) EXP1_SE_IO_10(nc) EXP1_SE_IO_9(nc) EXP1_SE_IO_11(nc) EXP2_SE_IO_0(nc) EXP2_SE_IO_2(nc) EXP2_SE_IO_1(nc) EXP2_SE_IO_3(nc) EXP2_SE_IO_4(nc) EXP2_SE_IO_6(nc) EXP2_SE_IO_8(nc) EXP2_SE_IO_10(nc) EXP2_SE_IO_28(nc) EXP2_SE_IO_29(nc) EXP2_SE_IO_5(nc) EXP2_SE_IO_7(nc) EXP2_SE_IO_9(nc) EXP2_SE_IO_11(nc) EXP1_SE_IO_28(out) EXP1_SE_IO_29(out) EXP2_SE_IO_12_14_DIFF_22_N(io) EXP2_SE_IO_12_14_DIFF_22_P(io) EXP2_SE_IO_13_15_DIFF_23_N(io) EXP2_SE_IO_13_15_DIFF_23_P(io) VCC_EXP2_3V3(pwr) VCC_EXP2_2V5(pwr) VCC_EXP1_2V5(pwr) VCC_EXP1_3V3(pwr) EXP1_SE_CLK_OUT(io) EXP1_DIFF_CLK_OUT_N(io) EXP1_DIFF_CLK_OUT_P(io) EXP2_DIFF_CLK_OUT_N(io) EXP2_DIFF_CLK_OUT_P(io)
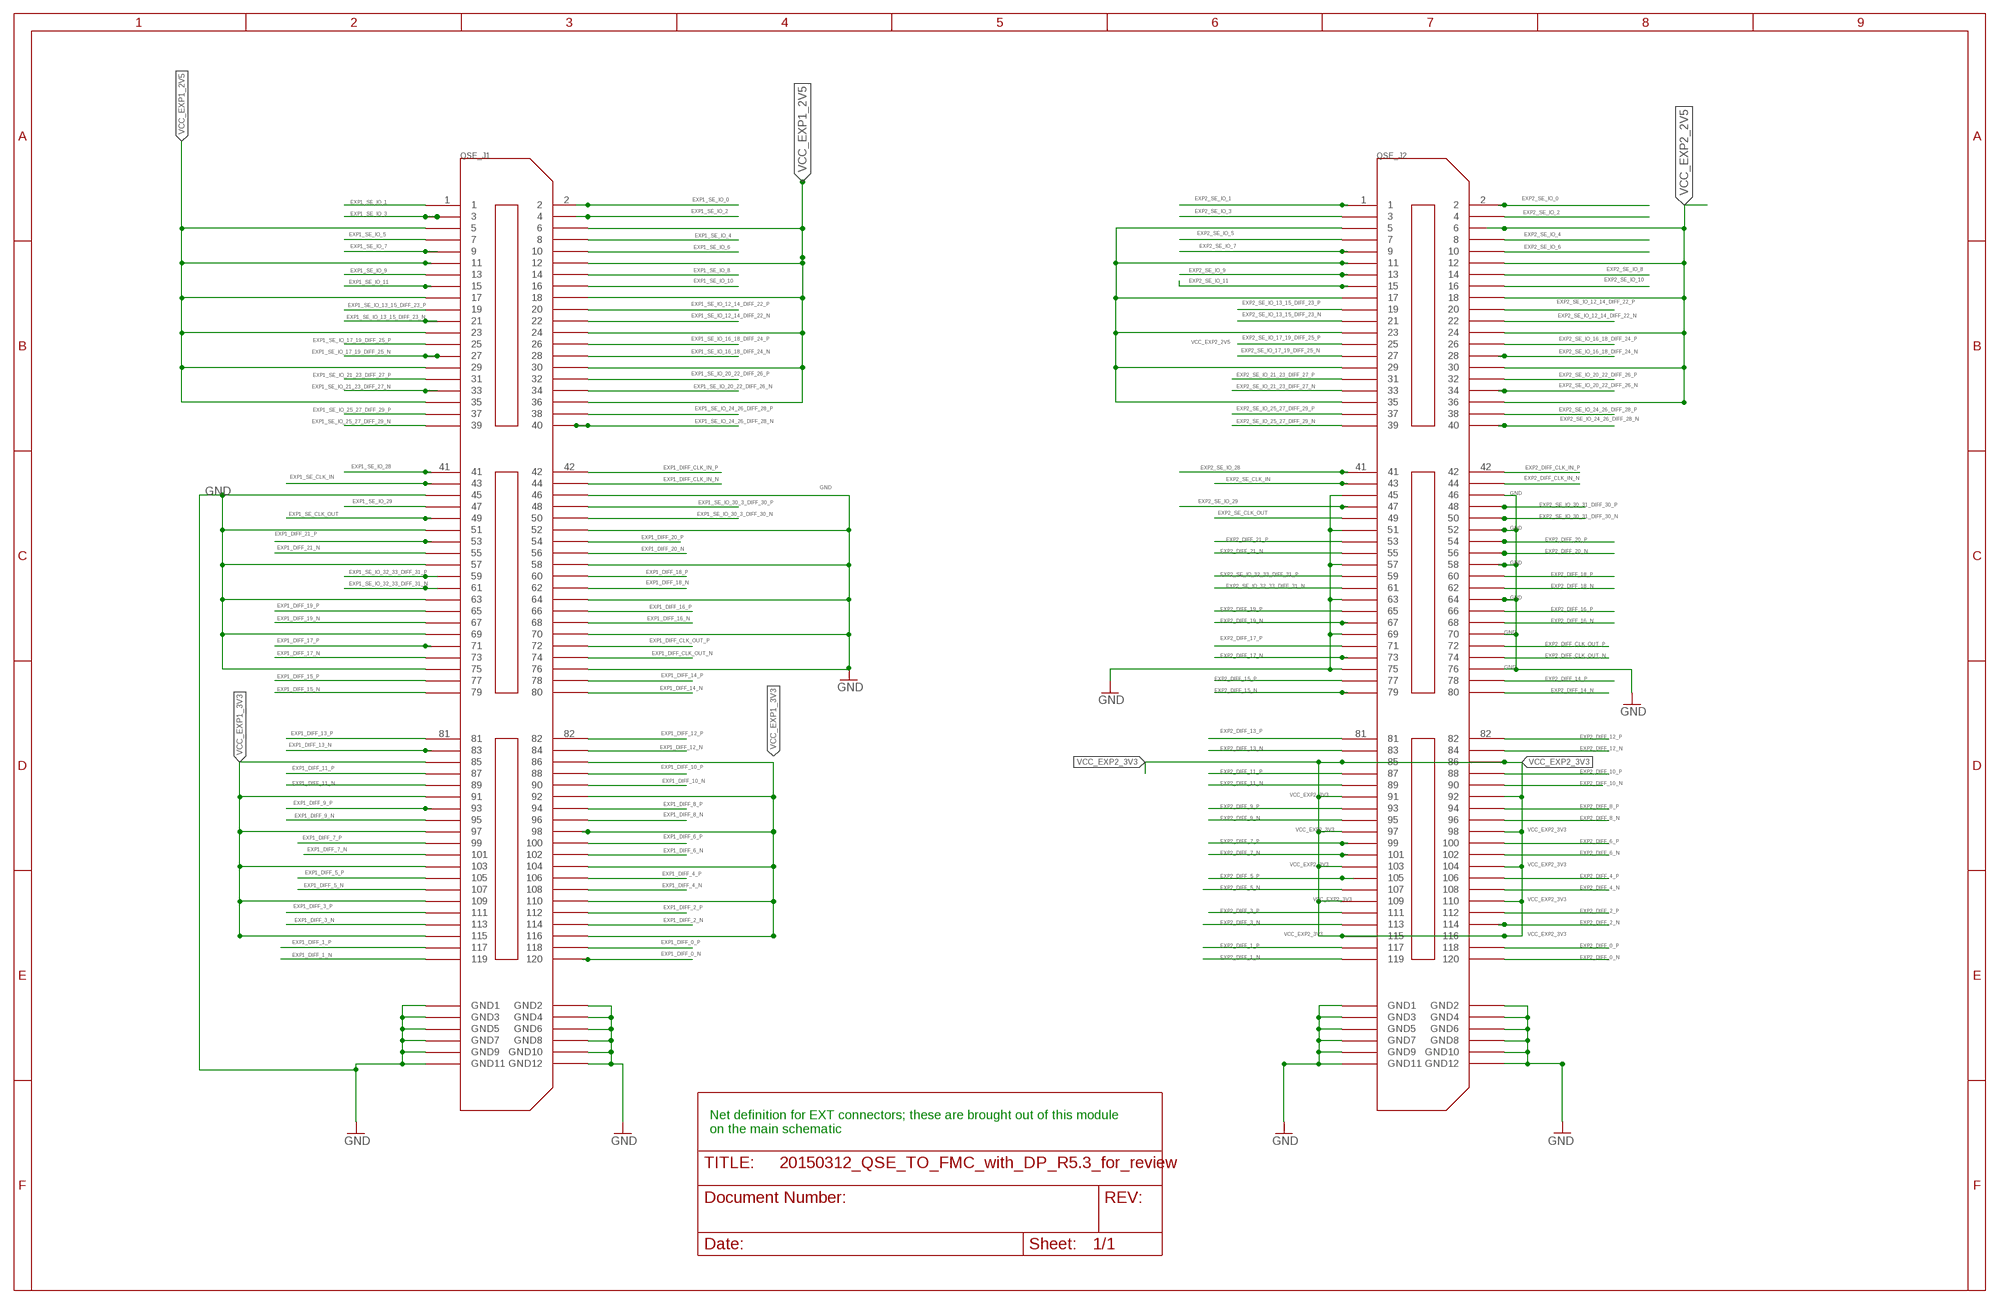
[diagram p3: schematic, module EXT_1_EXT_2, sheet 1]

### Parts
QSE_J1  QSE-060-01  [QSE-060-01]
QSE_J2  QSE-060-01  [QSE-060-01]

### Nets
EXP1_DIFF_0_N [gen_sig]: QSE_J1.120
EXP1_DIFF_0_P [gen_sig]: QSE_J1.118
EXP1_DIFF_1_N [gen_sig]: QSE_J1.119
EXP1_DIFF_1_P [gen_sig]: QSE_J1.117
EXP1_DIFF_2_N [gen_sig]: QSE_J1.114
EXP1_DIFF_2_P [gen_sig]: QSE_J1.112
EXP1_DIFF_3_N [gen_sig]: QSE_J1.113
EXP1_DIFF_3_P [gen_sig]: QSE_J1.111
EXP1_DIFF_4_N [gen_sig]: QSE_J1.108
EXP1_DIFF_4_P [gen_sig]: QSE_J1.106
EXP1_DIFF_5_N [gen_sig]: QSE_J1.107
EXP1_DIFF_5_P [gen_sig]: QSE_J1.105
EXP1_DIFF_6_N [gen_sig]: QSE_J1.102
EXP1_DIFF_6_P [gen_sig]: QSE_J1.100
EXP1_DIFF_7_N [gen_sig]: QSE_J1.101
EXP1_DIFF_7_P [gen_sig]: QSE_J1.99
EXP1_DIFF_8_N [gen_sig]: QSE_J1.96
EXP1_DIFF_8_P [gen_sig]: QSE_J1.94
EXP1_DIFF_9_N [gen_sig]: QSE_J1.95
EXP1_DIFF_9_P [gen_sig]: QSE_J1.93
EXP1_DIFF_10_N [gen_sig]: QSE_J1.90
EXP1_DIFF_10_P [gen_sig]: QSE_J1.88
EXP1_DIFF_11_N [gen_sig]: QSE_J1.89
EXP1_DIFF_11_P [gen_sig]: QSE_J1.87
EXP1_DIFF_12_N [gen_sig]: QSE_J1.84
EXP1_DIFF_12_P [gen_sig]: QSE_J1.82
EXP1_DIFF_13_N [gen_sig]: QSE_J1.83
EXP1_DIFF_13_P [gen_sig]: QSE_J1.81
EXP1_DIFF_14_N [gen_sig]: QSE_J1.80
EXP1_DIFF_14_P [gen_sig]: QSE_J1.78
EXP1_DIFF_15_N [gen_sig]: QSE_J1.79
EXP1_DIFF_15_P [gen_sig]: QSE_J1.77
EXP1_DIFF_16_N [gen_sig]: QSE_J1.68
EXP1_DIFF_16_P [gen_sig]: QSE_J1.66
EXP1_DIFF_17_N [gen_sig]: QSE_J1.73
EXP1_DIFF_17_P [gen_sig]: QSE_J1.71
EXP1_DIFF_18_N [gen_sig]: QSE_J1.62
EXP1_DIFF_18_P [gen_sig]: QSE_J1.60
EXP1_DIFF_19_N [gen_sig]: QSE_J1.67
EXP1_DIFF_19_P [gen_sig]: QSE_J1.65
EXP1_DIFF_20_N [gen_sig]: QSE_J1.56
EXP1_DIFF_20_P [gen_sig]: QSE_J1.54
EXP1_DIFF_21_N [gen_sig]: QSE_J1.55
EXP1_DIFF_21_P [gen_sig]: QSE_J1.53
EXP1_DIFF_CLK_IN_N [gen_sig]: QSE_J1.44
EXP1_DIFF_CLK_IN_P [gen_sig]: QSE_J1.42
EXP1_DIFF_CLK_OUT_N [gen_sig]: QSE_J1.74
EXP1_DIFF_CLK_OUT_P [gen_sig]: QSE_J1.72
EXP1_SE_CLK_IN [gen_sig]: QSE_J1.43
EXP1_SE_CLK_OUT [gen_sig]: QSE_J1.49
EXP1_SE_IO_0 [gen_sig]: QSE_J1.2
EXP1_SE_IO_1 [gen_sig]: QSE_J1.1
EXP1_SE_IO_2 [gen_sig]: QSE_J1.4
EXP1_SE_IO_3 [gen_sig]: QSE_J1.3
EXP1_SE_IO_4 [gen_sig]: QSE_J1.8
EXP1_SE_IO_5 [gen_sig]: QSE_J1.7
EXP1_SE_IO_6 [gen_sig]: QSE_J1.10
EXP1_SE_IO_7 [gen_sig]: QSE_J1.9
EXP1_SE_IO_8 [gen_sig]: QSE_J1.14
EXP1_SE_IO_9 [gen_sig]: QSE_J1.13
EXP1_SE_IO_10 [gen_sig]: QSE_J1.16
EXP1_SE_IO_11 [gen_sig]: QSE_J1.15
EXP1_SE_IO_12_14_DIFF_22_N [gen_sig]: QSE_J1.22
EXP1_SE_IO_12_14_DIFF_22_P [gen_sig]: QSE_J1.20
EXP1_SE_IO_13_15_DIFF_23_N [gen_sig]: QSE_J1.21
EXP1_SE_IO_13_15_DIFF_23_P [gen_sig]: QSE_J1.19
EXP1_SE_IO_16_18_DIFF_24_N [gen_sig]: QSE_J1.28
EXP1_SE_IO_16_18_DIFF_24_P [gen_sig]: QSE_J1.26
EXP1_SE_IO_17_19_DIFF_25_N [gen_sig]: QSE_J1.27
EXP1_SE_IO_17_19_DIFF_25_P [gen_sig]: QSE_J1.25
EXP1_SE_IO_20_22_DIFF_26_N [gen_sig]: QSE_J1.34
EXP1_SE_IO_20_22_DIFF_26_P [gen_sig]: QSE_J1.32
EXP1_SE_IO_21_23_DIFF_27_N [gen_sig]: QSE_J1.33
EXP1_SE_IO_21_23_DIFF_27_P [gen_sig]: QSE_J1.31
EXP1_SE_IO_24_26_DIFF_28_N [gen_sig]: QSE_J1.40
EXP1_SE_IO_24_26_DIFF_28_P [gen_sig]: QSE_J1.38
EXP1_SE_IO_25_27_DIFF_29_N [gen_sig]: QSE_J1.39
EXP1_SE_IO_25_27_DIFF_29_P [gen_sig]: QSE_J1.37
EXP1_SE_IO_28 [gen_sig]: QSE_J1.41
EXP1_SE_IO_29 [gen_sig]: QSE_J1.47
EXP1_SE_IO_30_3_DIFF_30_N [gen_sig]: QSE_J1.50
EXP1_SE_IO_30_3_DIFF_30_P [gen_sig]: QSE_J1.48
EXP1_SE_IO_32_33_DIFF_31_N [gen_sig]: QSE_J1.61
EXP1_SE_IO_32_33_DIFF_31_P [gen_sig]: QSE_J1.59
EXP2_DIFF_0_N [gen_sig]: QSE_J2.120
EXP2_DIFF_0_P [gen_sig]: QSE_J2.118
EXP2_DIFF_1_N [gen_sig]: QSE_J2.119
EXP2_DIFF_1_P [gen_sig]: QSE_J2.117
EXP2_DIFF_2_N [gen_sig]: QSE_J2.114
EXP2_DIFF_2_P [gen_sig]: QSE_J2.112
EXP2_DIFF_3_N [gen_sig]: QSE_J2.113
EXP2_DIFF_3_P [gen_sig]: QSE_J2.111
EXP2_DIFF_4_N [gen_sig]: QSE_J2.108
EXP2_DIFF_4_P [gen_sig]: QSE_J2.106
EXP2_DIFF_5_N [gen_sig]: QSE_J2.107
EXP2_DIFF_5_P [gen_sig]: QSE_J2.105
EXP2_DIFF_6_N [gen_sig]: QSE_J2.102
EXP2_DIFF_6_P [gen_sig]: QSE_J2.100
EXP2_DIFF_7_N [gen_sig]: QSE_J2.101
EXP2_DIFF_7_P [gen_sig]: QSE_J2.99
EXP2_DIFF_8_N [gen_sig]: QSE_J2.96
EXP2_DIFF_8_P [gen_sig]: QSE_J2.94
EXP2_DIFF_9_N [gen_sig]: QSE_J2.95
EXP2_DIFF_9_P [gen_sig]: QSE_J2.93
EXP2_DIFF_10_N [gen_sig]: QSE_J2.90
EXP2_DIFF_10_P [gen_sig]: QSE_J2.88
EXP2_DIFF_11_N [gen_sig]: QSE_J2.89
EXP2_DIFF_11_P [gen_sig]: QSE_J2.87
EXP2_DIFF_12_N [gen_sig]: QSE_J2.84
EXP2_DIFF_12_P [gen_sig]: QSE_J2.82
EXP2_DIFF_13_N [gen_sig]: QSE_J2.83
EXP2_DIFF_13_P [gen_sig]: QSE_J2.81
EXP2_DIFF_14_N [gen_sig]: QSE_J2.80
EXP2_DIFF_14_P [gen_sig]: QSE_J2.78
EXP2_DIFF_15_N [gen_sig]: QSE_J2.79
EXP2_DIFF_15_P [gen_sig]: QSE_J2.77
EXP2_DIFF_16_N [gen_sig]: QSE_J2.68
EXP2_DIFF_16_P [gen_sig]: QSE_J2.66
EXP2_DIFF_17_N [gen_sig]: QSE_J2.73
EXP2_DIFF_17_P [gen_sig]: QSE_J2.71
EXP2_DIFF_18_N [gen_sig]: QSE_J2.62
EXP2_DIFF_18_P [gen_sig]: QSE_J2.60
EXP2_DIFF_19_N [gen_sig]: QSE_J2.67
EXP2_DIFF_19_P [gen_sig]: QSE_J2.65
EXP2_DIFF_20_N [gen_sig]: QSE_J2.56
EXP2_DIFF_20_P [gen_sig]: QSE_J2.54
EXP2_DIFF_21_N [gen_sig]: QSE_J2.55
EXP2_DIFF_21_P [gen_sig]: QSE_J2.53
EXP2_DIFF_CLK_IN_N [gen_sig]: QSE_J2.44
EXP2_DIFF_CLK_IN_P [gen_sig]: QSE_J2.42
EXP2_DIFF_CLK_OUT_N [gen_sig]: QSE_J2.74
EXP2_DIFF_CLK_OUT_P [gen_sig]: QSE_J2.72
EXP2_SE_CLK_IN [gen_sig]: QSE_J2.43
EXP2_SE_CLK_OUT [gen_sig]: QSE_J2.49
EXP2_SE_IO_0 [gen_sig]: QSE_J2.2
EXP2_SE_IO_1 [gen_sig]: QSE_J2.1
EXP2_SE_IO_2 [gen_sig]: QSE_J2.4
EXP2_SE_IO_3 [gen_sig]: QSE_J2.3
EXP2_SE_IO_4 [gen_sig]: QSE_J2.8
EXP2_SE_IO_5 [gen_sig]: QSE_J2.7
EXP2_SE_IO_6 [gen_sig]: QSE_J2.10
EXP2_SE_IO_7 [gen_sig]: QSE_J2.9
EXP2_SE_IO_8 [gen_sig]: QSE_J2.14
EXP2_SE_IO_9 [gen_sig]: QSE_J2.13
EXP2_SE_IO_10 [gen_sig]: QSE_J2.16
EXP2_SE_IO_11 [gen_sig]: QSE_J2.15
EXP2_SE_IO_12_14_DIFF_22_N [gen_sig]: QSE_J2.22
EXP2_SE_IO_12_14_DIFF_22_P [gen_sig]: QSE_J2.20
EXP2_SE_IO_13_15_DIFF_23_N [gen_sig]: QSE_J2.21
EXP2_SE_IO_13_15_DIFF_23_P [gen_sig]: QSE_J2.19
EXP2_SE_IO_16_18_DIFF_24_N [gen_sig]: QSE_J2.28
EXP2_SE_IO_16_18_DIFF_24_P [gen_sig]: QSE_J2.26
EXP2_SE_IO_17_19_DIFF_25_N [gen_sig]: QSE_J2.27
EXP2_SE_IO_17_19_DIFF_25_P [gen_sig]: QSE_J2.25
EXP2_SE_IO_20_22_DIFF_26_N [gen_sig]: QSE_J2.34
EXP2_SE_IO_20_22_DIFF_26_P [gen_sig]: QSE_J2.32
EXP2_SE_IO_21_23_DIFF_27_N [gen_sig]: QSE_J2.33
EXP2_SE_IO_21_23_DIFF_27_P [gen_sig]: QSE_J2.31
EXP2_SE_IO_24_26_DIFF_28_N [gen_sig]: QSE_J2.40
EXP2_SE_IO_24_26_DIFF_28_P [gen_sig]: QSE_J2.38
EXP2_SE_IO_25_27_DIFF_29_N [gen_sig]: QSE_J2.39
EXP2_SE_IO_25_27_DIFF_29_P [gen_sig]: QSE_J2.37
EXP2_SE_IO_28 [gen_sig]: QSE_J2.41
EXP2_SE_IO_29 [gen_sig]: QSE_J2.47
EXP2_SE_IO_30_31_DIFF_30_N [gen_sig]: QSE_J2.50
EXP2_SE_IO_30_31_DIFF_30_P [gen_sig]: QSE_J2.48
EXP2_SE_IO_32_33_DIFF_31_N [gen_sig]: QSE_J2.61
EXP2_SE_IO_32_33_DIFF_31_P [gen_sig]: QSE_J2.59
GND [GND]: QSE_J1.45 QSE_J1.46 QSE_J1.51 QSE_J1.52 QSE_J1.57 QSE_J1.58 QSE_J1.63 QSE_J1.64 QSE_J1.69 QSE_J1.70 QSE_J1.75 QSE_J1.76 QSE_J1.GND1 QSE_J1.GND2 QSE_J1.GND3 QSE_J1.GND4 QSE_J1.GND5 QSE_J1.GND6 QSE_J1.GND7 QSE_J1.GND8 QSE_J1.GND9 QSE_J1.GND10 QSE_J1.GND11 QSE_J1.GND12 QSE_J2.45 QSE_J2.46 QSE_J2.51 QSE_J2.52 QSE_J2.57 QSE_J2.58 QSE_J2.63 QSE_J2.64 QSE_J2.69 QSE_J2.70 QSE_J2.75 QSE_J2.76 QSE_J2.GND1 QSE_J2.GND2 QSE_J2.GND3 QSE_J2.GND4 QSE_J2.GND5 QSE_J2.GND6 QSE_J2.GND7 QSE_J2.GND8 QSE_J2.GND9 QSE_J2.GND10 QSE_J2.GND11 QSE_J2.GND12
VCC_EXP1_2V5 [gen_sig]: QSE_J1.5 QSE_J1.6 QSE_J1.11 QSE_J1.12 QSE_J1.17 QSE_J1.18 QSE_J1.23 QSE_J1.24 QSE_J1.29 QSE_J1.30 QSE_J1.35 QSE_J1.36
VCC_EXP1_3V3 [gen_sig]: QSE_J1.85 QSE_J1.86 QSE_J1.91 QSE_J1.92 QSE_J1.97 QSE_J1.98 QSE_J1.103 QSE_J1.104 QSE_J1.109 QSE_J1.110 QSE_J1.115 QSE_J1.116
VCC_EXP2_2V5 [gen_sig]: QSE_J2.5 QSE_J2.6 QSE_J2.11 QSE_J2.12 QSE_J2.17 QSE_J2.18 QSE_J2.23 QSE_J2.24 QSE_J2.29 QSE_J2.30 QSE_J2.35 QSE_J2.36
VCC_EXP2_3V3 [gen_sig]: QSE_J2.85 QSE_J2.86 QSE_J2.91 QSE_J2.92 QSE_J2.97 QSE_J2.98 QSE_J2.103 QSE_J2.104 QSE_J2.109 QSE_J2.110 QSE_J2.115 QSE_J2.116

### Notes on the sheet
- Net definition for EXT connectors; these are brought out of this module
  on the main schematic

### Library data of the parts
QSE_J1 QSE_J2 = con-samtec-qxe:QSE-060-01; MPN: QSE-060-01-L-D-A; OC_NEWARK: 80K8259